# Altium project GECKO3.PRJPCB (part 2 of 4)

## Sheet fpga-config.SCHDOC: FPGA Configuration and Decoupling
size A3; Organization: Berne University of Applied Science; Address1: School of Engineering and; Address2: Information Technology; Address3: Quellgasse 21; Address4: CH-2501 Biel; Revision: 1.0; SheetNumber: 5; SheetTotal: 19; ApprovedBy: zem1; Author: zac1
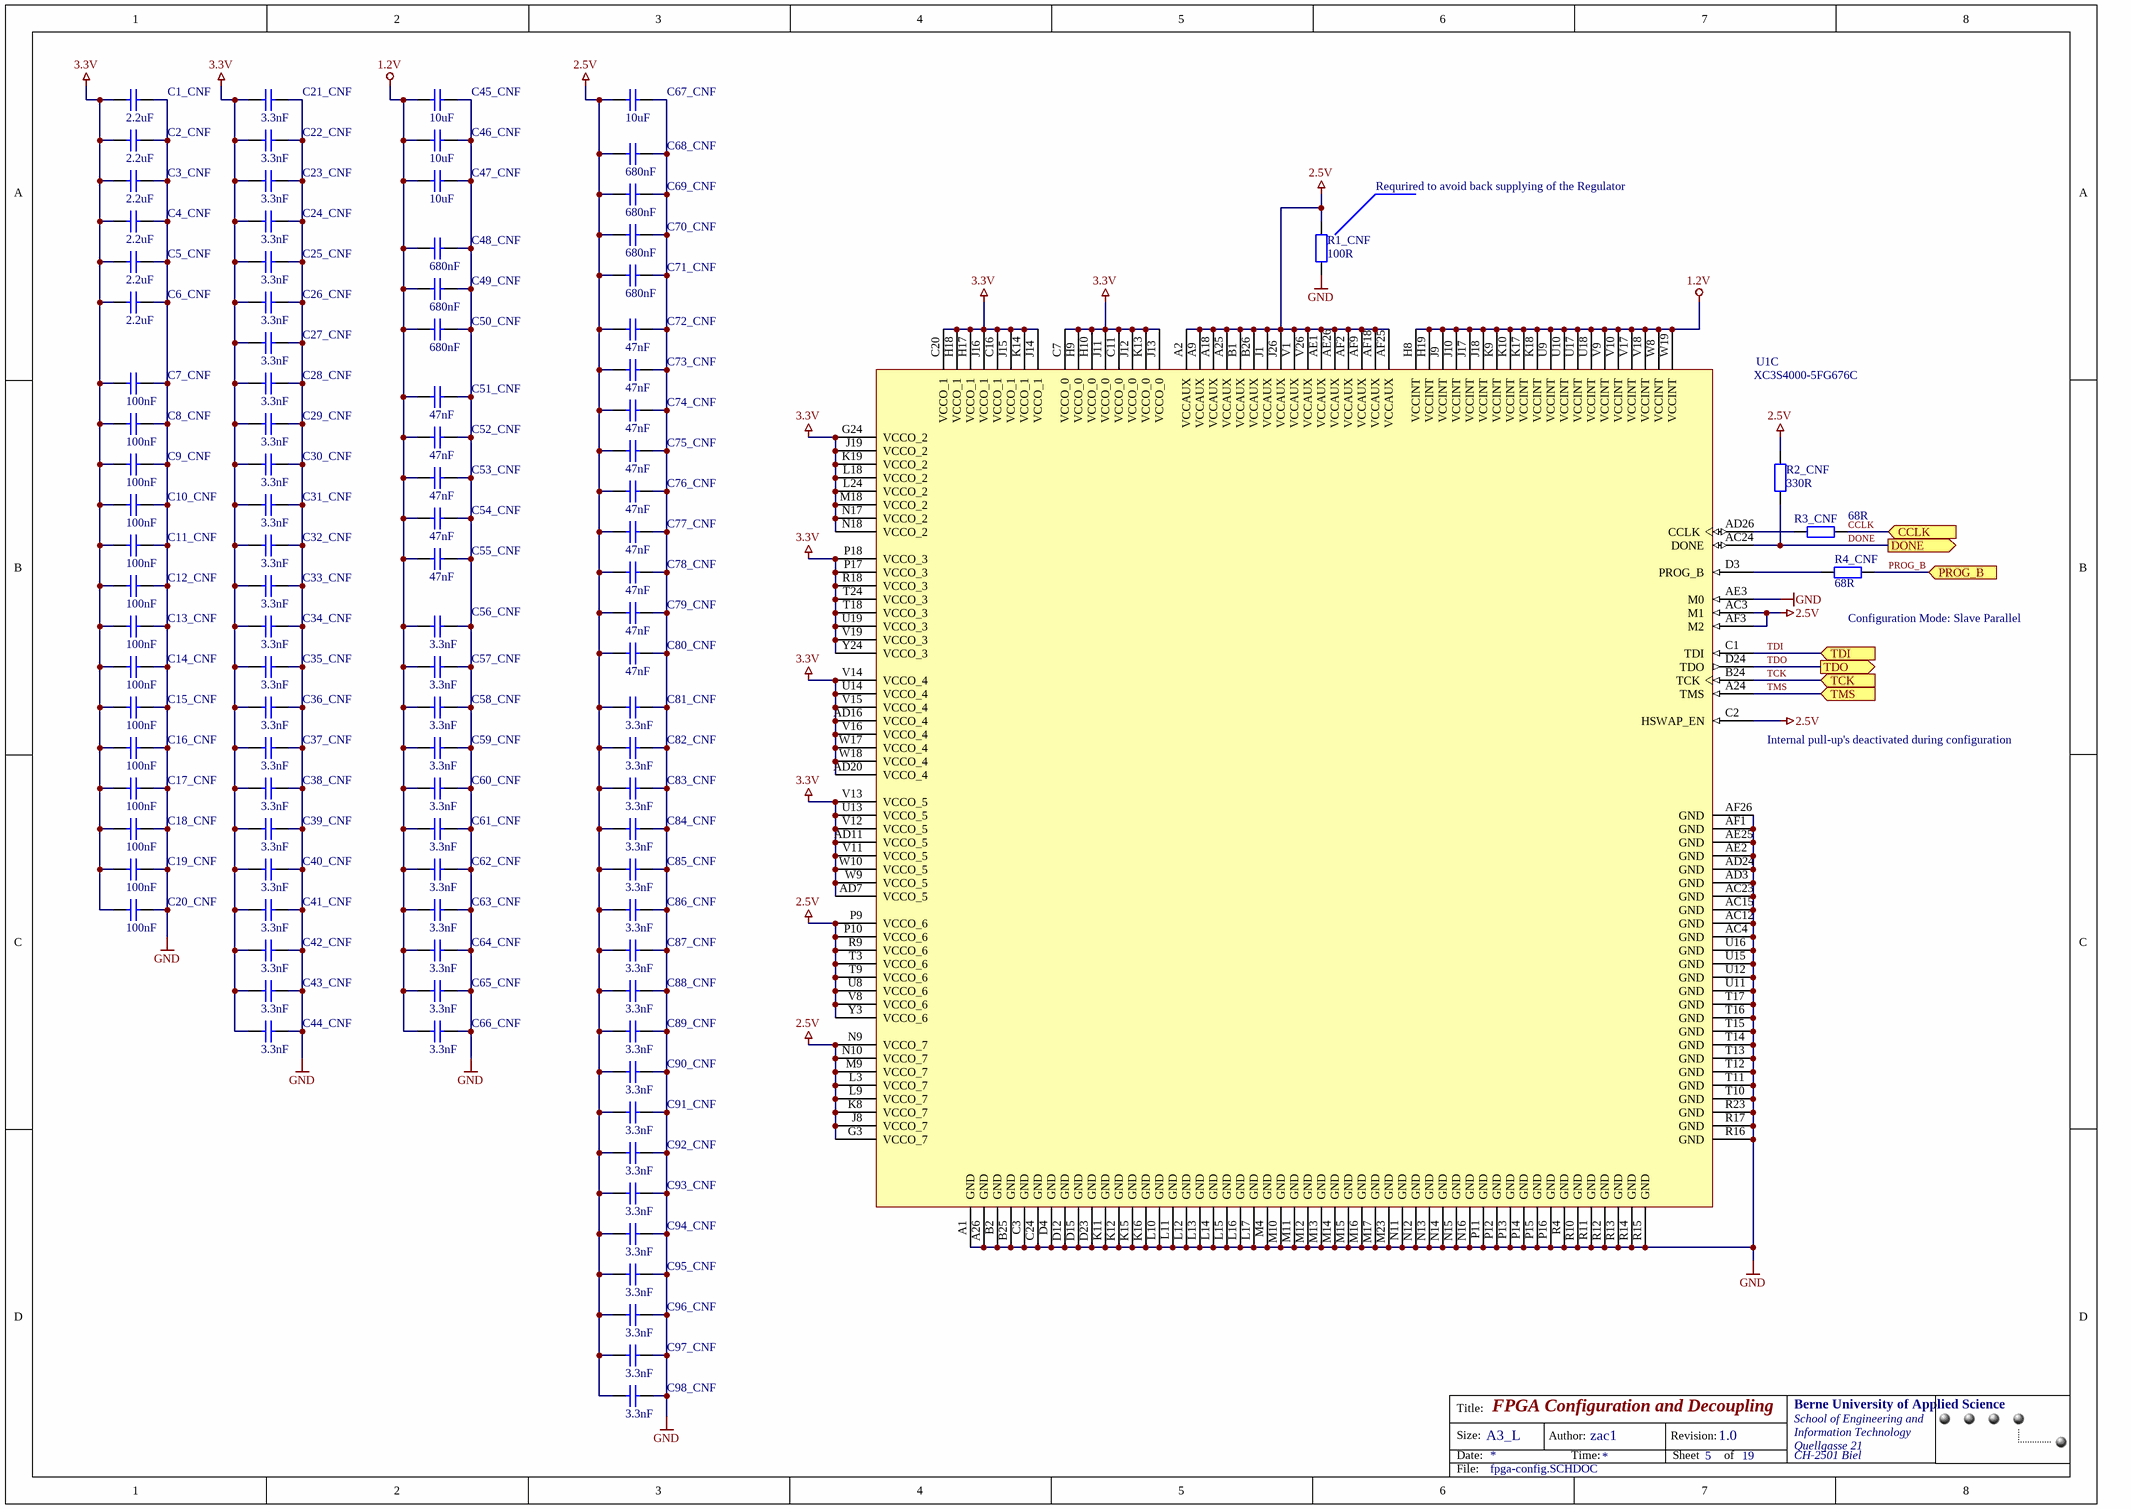
[diagram p3: fpga-config.SCHDOC]

### Parts
C1_CNF  value 2.2uF  [0805]  (hidden comment: Cap)
C2_CNF  value 2.2uF  [0805]  (hidden comment: Cap)
C3_CNF  value 2.2uF  [0805]  (hidden comment: Cap)
C4_CNF  value 2.2uF  [0805]  (hidden comment: Cap)
C5_CNF  value 2.2uF  [0805]  (hidden comment: Cap)
C6_CNF  value 2.2uF  [0805]  (hidden comment: Cap)
C7_CNF  value 100nF  [0402]  (hidden comment: Cap)
C8_CNF  value 100nF  [0402]  (hidden comment: Cap)
C9_CNF  value 100nF  [0402]  (hidden comment: Cap)
C10_CNF  value 100nF  [0402]  (hidden comment: Cap)
C11_CNF  value 100nF  [0402]  (hidden comment: Cap)
C12_CNF  value 100nF  [0402]  (hidden comment: Cap)
C13_CNF  value 100nF  [0402]  (hidden comment: Cap)
C14_CNF  value 100nF  [0402]  (hidden comment: Cap)
C15_CNF  value 100nF  [0402]  (hidden comment: Cap)
C16_CNF  value 100nF  [0402]  (hidden comment: Cap)
C17_CNF  value 100nF  [0402]  (hidden comment: Cap)
C18_CNF  value 100nF  [0402]  (hidden comment: Cap)
C19_CNF  value 100nF  [0402]  (hidden comment: Cap)
C20_CNF  value 100nF  [0402]  (hidden comment: Cap)
C21_CNF  value 3.3nF  [0402]  (hidden comment: Cap)
C22_CNF  value 3.3nF  [0402]  (hidden comment: Cap)
C23_CNF  value 3.3nF  [0402]  (hidden comment: Cap)
C24_CNF  value 3.3nF  [0402]  (hidden comment: Cap)
C25_CNF  value 3.3nF  [0402]  (hidden comment: Cap)
C26_CNF  value 3.3nF  [0402]  (hidden comment: Cap)
C27_CNF  value 3.3nF  [0402]  (hidden comment: Cap)
C28_CNF  value 3.3nF  [0402]  (hidden comment: Cap)
C29_CNF  value 3.3nF  [0402]  (hidden comment: Cap)
C30_CNF  value 3.3nF  [0402]  (hidden comment: Cap)
C31_CNF  value 3.3nF  [0402]  (hidden comment: Cap)
C32_CNF  value 3.3nF  [0402]  (hidden comment: Cap)
C33_CNF  value 3.3nF  [0402]  (hidden comment: Cap)
C34_CNF  value 3.3nF  [0402]  (hidden comment: Cap)
C35_CNF  value 3.3nF  [0402]  (hidden comment: Cap)
C36_CNF  value 3.3nF  [0402]  (hidden comment: Cap)
C37_CNF  value 3.3nF  [0402]  (hidden comment: Cap)
C38_CNF  value 3.3nF  [0402]  (hidden comment: Cap)
C39_CNF  value 3.3nF  [0402]  (hidden comment: Cap)
C40_CNF  value 3.3nF  [0402]  (hidden comment: Cap)
C41_CNF  value 3.3nF  [0402]  (hidden comment: Cap)
C42_CNF  value 3.3nF  [0402]  (hidden comment: Cap)
C43_CNF  value 3.3nF  [0402]  (hidden comment: Cap)
C44_CNF  value 3.3nF  [0402]  (hidden comment: Cap)
C45_CNF  value 10uF  [1206]  (hidden comment: Cap)
C46_CNF  value 10uF  [1206]  (hidden comment: Cap)
C47_CNF  value 10uF  [1206]  (hidden comment: Cap)
C48_CNF  value 680nF  [0805]  (hidden comment: Cap)
C49_CNF  value 680nF  [0805]  (hidden comment: Cap)
C50_CNF  value 680nF  [0805]  (hidden comment: Cap)
C51_CNF  value 47nF  [0402]  (hidden comment: Cap)
C52_CNF  value 47nF  [0402]  (hidden comment: Cap)
C53_CNF  value 47nF  [0402]  (hidden comment: Cap)
C54_CNF  value 47nF  [0402]  (hidden comment: Cap)
C55_CNF  value 47nF  [0402]  (hidden comment: Cap)
C56_CNF  value 3.3nF  [0402]  (hidden comment: Cap)
C57_CNF  value 3.3nF  [0402]  (hidden comment: Cap)
C58_CNF  value 3.3nF  [0402]  (hidden comment: Cap)
C59_CNF  value 3.3nF  [0402]  (hidden comment: Cap)
C60_CNF  value 3.3nF  [0402]  (hidden comment: Cap)
C61_CNF  value 3.3nF  [0402]  (hidden comment: Cap)
C62_CNF  value 3.3nF  [0402]  (hidden comment: Cap)
C63_CNF  value 3.3nF  [0402]  (hidden comment: Cap)
C64_CNF  value 3.3nF  [0402]  (hidden comment: Cap)
C65_CNF  value 3.3nF  [0402]  (hidden comment: Cap)
C66_CNF  value 3.3nF  [0402]  (hidden comment: Cap)
C67_CNF  value 10uF  [1206]  (hidden comment: Cap)
C68_CNF  value 680nF  [0805]  (hidden comment: Cap)
C69_CNF  value 680nF  [0805]  (hidden comment: Cap)
C70_CNF  value 680nF  [0805]  (hidden comment: Cap)
C71_CNF  value 680nF  [0805]  (hidden comment: Cap)
C72_CNF  value 47nF  [0402]  (hidden comment: Cap)
C73_CNF  value 47nF  [0402]  (hidden comment: Cap)
C74_CNF  value 47nF  [0402]  (hidden comment: Cap)
C75_CNF  value 47nF  [0402]  (hidden comment: Cap)
C76_CNF  value 47nF  [0402]  (hidden comment: Cap)
C77_CNF  value 47nF  [0402]  (hidden comment: Cap)
C78_CNF  value 47nF  [0402]  (hidden comment: Cap)
C79_CNF  value 47nF  [0402]  (hidden comment: Cap)
C80_CNF  value 47nF  [0402]  (hidden comment: Cap)
C81_CNF  value 3.3nF  [0402]  (hidden comment: Cap)
C82_CNF  value 3.3nF  [0402]  (hidden comment: Cap)
C83_CNF  value 3.3nF  [0402]  (hidden comment: Cap)
C84_CNF  value 3.3nF  [0402]  (hidden comment: Cap)
C85_CNF  value 3.3nF  [0402]  (hidden comment: Cap)
C86_CNF  value 3.3nF  [0402]  (hidden comment: Cap)
C87_CNF  value 3.3nF  [0402]  (hidden comment: Cap)
C88_CNF  value 3.3nF  [0402]  (hidden comment: Cap)
C89_CNF  value 3.3nF  [0402]  (hidden comment: Cap)
C90_CNF  value 3.3nF  [0402]  (hidden comment: Cap)
C91_CNF  value 3.3nF  [0402]  (hidden comment: Cap)
C92_CNF  value 3.3nF  [0402]  (hidden comment: Cap)
C93_CNF  value 3.3nF  [0402]  (hidden comment: Cap)
C94_CNF  value 3.3nF  [0402]  (hidden comment: Cap)
C95_CNF  value 3.3nF  [0402]  (hidden comment: Cap)
C96_CNF  value 3.3nF  [0402]  (hidden comment: Cap)
C97_CNF  value 3.3nF  [0402]  (hidden comment: Cap)
C98_CNF  value 3.3nF  [0402]  (hidden comment: Cap)
R1_CNF  value 100R  [0402]  (hidden comment: Res2)
R2_CNF  value 330R  [0402]  (hidden comment: Res2)
R3_CNF  value 68R  [0402]  (hidden comment: Res2)
R4_CNF  value 68R  [0402]  (hidden comment: Res2)
U1  XC3S4000-5FG676C  [FG676]  (part C of 3)

### Ports
CCLK (in), DONE (out), PROG_B (in), TCK (in), TDI (in), TDO (out), TMS (in)

### Nets
1.2V: C45_CNF.2 C46_CNF.2 C47_CNF.2 C48_CNF.2 C49_CNF.2 C50_CNF.2 C51_CNF.2 C52_CNF.2 C53_CNF.2 C54_CNF.2 C55_CNF.2 C56_CNF.2 C57_CNF.2 C58_CNF.2 C59_CNF.2 C60_CNF.2 C61_CNF.2 C62_CNF.2 C63_CNF.2 C64_CNF.2 C65_CNF.2 C66_CNF.2 U1.H8(VCCINT) U1.H19(VCCINT) U1.J9(VCCINT) U1.J10(VCCINT) U1.J17(VCCINT) U1.J18(VCCINT) U1.K9(VCCINT) U1.K10(VCCINT) U1.K17(VCCINT) U1.K18(VCCINT) U1.U9(VCCINT) U1.U10(VCCINT) U1.U17(VCCINT) U1.U18(VCCINT) U1.V9(VCCINT) U1.V10(VCCINT) U1.V17(VCCINT) U1.V18(VCCINT) U1.W8(VCCINT) U1.W19(VCCINT)
2.5V: C67_CNF.2 C68_CNF.2 C69_CNF.2 C70_CNF.2 C71_CNF.2 C72_CNF.2 C73_CNF.2 C74_CNF.2 C75_CNF.2 C76_CNF.2 C77_CNF.2 C78_CNF.2 C79_CNF.2 C80_CNF.2 C81_CNF.2 C82_CNF.2 C83_CNF.2 C84_CNF.2 C85_CNF.2 C86_CNF.2 C87_CNF.2 C88_CNF.2 C89_CNF.2 C90_CNF.2 C91_CNF.2 C92_CNF.2 C93_CNF.2 C94_CNF.2 C95_CNF.2 C96_CNF.2 C97_CNF.2 C98_CNF.2 R1_CNF.1 R2_CNF.1 U1.A2(VCCAUX) U1.A9(VCCAUX) U1.A18(VCCAUX) U1.A25(VCCAUX) U1.AC3(M1) U1.AE1(VCCAUX) U1.AE26(VCCAUX) U1.AF2(VCCAUX) U1.AF3(M2) U1.AF9(VCCAUX) U1.AF18(VCCAUX) U1.AF25(VCCAUX) U1.B1(VCCAUX) U1.B26(VCCAUX) U1.C2(HSWAP_EN) U1.G3(VCCO_7) U1.J1(VCCAUX) U1.J8(VCCO_7) U1.J26(VCCAUX) U1.K8(VCCO_7) U1.L3(VCCO_7) U1.L9(VCCO_7) U1.M9(VCCO_7) U1.N9(VCCO_7) U1.N10(VCCO_7) U1.P9(VCCO_6) U1.P10(VCCO_6) U1.R9(VCCO_6) U1.T3(VCCO_6) U1.T9(VCCO_6) U1.U8(VCCO_6) U1.V1(VCCAUX) U1.V8(VCCO_6) U1.V26(VCCAUX) U1.Y3(VCCO_6)
3.3V: C1_CNF.1 C2_CNF.1 C3_CNF.1 C4_CNF.1 C5_CNF.1 C6_CNF.1 C7_CNF.2 C8_CNF.2 C9_CNF.2 C10_CNF.2 C11_CNF.2 C12_CNF.2 C13_CNF.2 C14_CNF.2 C15_CNF.2 C16_CNF.2 C17_CNF.2 C18_CNF.2 C19_CNF.2 C20_CNF.2 C21_CNF.2 C22_CNF.2 C23_CNF.2 C24_CNF.2 C25_CNF.2 C26_CNF.2 C27_CNF.2 C28_CNF.2 C29_CNF.2 C30_CNF.2 C31_CNF.2 C32_CNF.2 C33_CNF.2 C34_CNF.2 C35_CNF.2 C36_CNF.2 C37_CNF.2 C38_CNF.2 C39_CNF.2 C40_CNF.2 C41_CNF.2 C42_CNF.2 C43_CNF.2 C44_CNF.2 U1.AD7(VCCO_5) U1.AD11(VCCO_5) U1.AD16(VCCO_4) U1.AD20(VCCO_4) U1.C7(VCCO_0) U1.C11(VCCO_0) U1.C16(VCCO_1) U1.C20(VCCO_1) U1.G24(VCCO_2) U1.H9(VCCO_0) U1.H10(VCCO_0) U1.H17(VCCO_1) U1.H18(VCCO_1) U1.J11(VCCO_0) U1.J12(VCCO_0) U1.J13(VCCO_0) U1.J14(VCCO_1) U1.J15(VCCO_1) U1.J16(VCCO_1) U1.J19(VCCO_2) U1.K13(VCCO_0) U1.K14(VCCO_1) U1.K19(VCCO_2) U1.L18(VCCO_2) U1.L24(VCCO_2) U1.M18(VCCO_2) U1.N17(VCCO_2) U1.N18(VCCO_2) U1.P17(VCCO_3) U1.P18(VCCO_3) U1.R18(VCCO_3) U1.T18(VCCO_3) U1.T24(VCCO_3) U1.U13(VCCO_5) U1.U14(VCCO_4) U1.U19(VCCO_3) U1.V11(VCCO_5) U1.V12(VCCO_5) U1.V13(VCCO_5) U1.V14(VCCO_4) U1.V15(VCCO_4) U1.V16(VCCO_4) U1.V19(VCCO_3) U1.W9(VCCO_5) U1.W10(VCCO_5) U1.W17(VCCO_4) U1.W18(VCCO_4) U1.Y24(VCCO_3)
GND: C1_CNF.2 C2_CNF.2 C3_CNF.2 C4_CNF.2 C5_CNF.2 C6_CNF.2 C7_CNF.1 C8_CNF.1 C9_CNF.1 C10_CNF.1 C11_CNF.1 C12_CNF.1 C13_CNF.1 C14_CNF.1 C15_CNF.1 C16_CNF.1 C17_CNF.1 C18_CNF.1 C19_CNF.1 C20_CNF.1 C21_CNF.1 C22_CNF.1 C23_CNF.1 C24_CNF.1 C25_CNF.1 C26_CNF.1 C27_CNF.1 C28_CNF.1 C29_CNF.1 C30_CNF.1 C31_CNF.1 C32_CNF.1 C33_CNF.1 C34_CNF.1 C35_CNF.1 C36_CNF.1 C37_CNF.1 C38_CNF.1 C39_CNF.1 C40_CNF.1 C41_CNF.1 C42_CNF.1 C43_CNF.1 C44_CNF.1 C45_CNF.1 C46_CNF.1 C47_CNF.1 C48_CNF.1 C49_CNF.1 C50_CNF.1 C51_CNF.1 C52_CNF.1 C53_CNF.1 C54_CNF.1 C55_CNF.1 C56_CNF.1 C57_CNF.1 C58_CNF.1 C59_CNF.1 C60_CNF.1 C61_CNF.1 C62_CNF.1 C63_CNF.1 C64_CNF.1 C65_CNF.1 C66_CNF.1 C67_CNF.1 C68_CNF.1 C69_CNF.1 C70_CNF.1 C71_CNF.1 C72_CNF.1 C73_CNF.1 C74_CNF.1 C75_CNF.1 C76_CNF.1 C77_CNF.1 C78_CNF.1 C79_CNF.1 C80_CNF.1 C81_CNF.1 C82_CNF.1 C83_CNF.1 C84_CNF.1 C85_CNF.1 C86_CNF.1 C87_CNF.1 C88_CNF.1 C89_CNF.1 C90_CNF.1 C91_CNF.1 C92_CNF.1 C93_CNF.1 C94_CNF.1 C95_CNF.1 C96_CNF.1 C97_CNF.1 C98_CNF.1 R1_CNF.2 U1.A1(GND) U1.A26(GND) U1.AC4(GND) U1.AC12(GND) U1.AC15(GND) U1.AC23(GND) U1.AD3(GND) U1.AD24(GND) U1.AE2(GND) U1.AE3(M0) U1.AE25(GND) U1.AF1(GND) U1.AF26(GND) U1.B2(GND) U1.B25(GND) U1.C3(GND) U1.C24(GND) U1.D4(GND) U1.D12(GND) U1.D15(GND) U1.D23(GND) U1.K11(GND) U1.K12(GND) U1.K15(GND) U1.K16(GND) U1.L10(GND) U1.L11(GND) U1.L12(GND) U1.L13(GND) U1.L14(GND) U1.L15(GND) U1.L16(GND) U1.L17(GND) U1.M4(GND) U1.M10(GND) U1.M11(GND) U1.M12(GND) U1.M13(GND) U1.M14(GND) U1.M15(GND) U1.M16(GND) U1.M17(GND) U1.M23(GND) U1.N11(GND) U1.N12(GND) U1.N13(GND) U1.N14(GND) U1.N15(GND) U1.N16(GND) U1.P11(GND) U1.P12(GND) U1.P13(GND) U1.P14(GND) U1.P15(GND) U1.P16(GND) U1.R4(GND) U1.R10(GND) U1.R11(GND) U1.R12(GND) U1.R13(GND) U1.R14(GND) U1.R15(GND) U1.R16(GND) U1.R17(GND) U1.R23(GND) U1.T10(GND) U1.T11(GND) U1.T12(GND) U1.T13(GND) U1.T14(GND) U1.T15(GND) U1.T16(GND) U1.T17(GND) U1.U11(GND) U1.U12(GND) U1.U15(GND) U1.U16(GND)
CCLK: R3_CNF.1 ; port CCLK
DONE: R2_CNF.2 U1.AC24(DONE) ; port DONE
PROG_B: R4_CNF.1 ; port PROG_B
TCK: U1.B24(TCK) ; port TCK
TDI: U1.C1(TDI) ; port TDI
TDO: U1.D24(TDO) ; port TDO
TMS: U1.A24(TMS) ; port TMS
NetR3_CNF_2: R3_CNF.2 U1.AD26(CCLK)
NetR4_CNF_2: R4_CNF.2 U1.D3(PROG_B)

### Notes on the sheet
- Requrired to avoid back supplying of the Regulator
- (near R4_CNF) Configuration Mode: Slave Parallel
- Internal pull-up's deactivated during configuration
- Title:
- Size:
- Date:
- A3_L
- Author:
- Time:
- Revision:
- Sheet
- of
- File:

### Library data of the parts
C1_CNF C2_CNF C3_CNF C4_CNF C5_CNF C6_CNF = Cap: Capacitor; Manufacturer: Murata; Part Number: GRM21BR71A225KA01L; Class I: Passive; Currency: CHF; Packaging unit: 1; Prize: 0.54; Published: 8-Jun-2000; Revision: July-2002: Re-released for DXP Platform.; Publisher: Altium Limited; Class II: Capacitor; Distributor Number: 823 517; RoHS: yes; Distributor: Distrelec
C7_CNF C8_CNF C9_CNF C10_CNF C11_CNF C12_CNF C13_CNF C14_CNF C15_CNF C16_CNF C17_CNF C18_CNF C19_CNF C20_CNF = Cap: as C11_PWR on sheet power; Published: 8-Jun-2000; Revision: July-2002: Re-released for DXP Platform.; Publisher: Altium Limited; Class II: Capacitor; Distributor Number: 8819 742; RoHS: yes; Distributor: Farnell
C21_CNF C22_CNF C23_CNF C24_CNF C25_CNF C26_CNF C27_CNF C28_CNF C29_CNF C30_CNF C31_CNF C32_CNF C33_CNF C34_CNF C35_CNF C36_CNF C37_CNF C38_CNF C39_CNF C40_CNF C41_CNF C42_CNF C43_CNF C44_CNF C56_CNF C57_CNF C58_CNF C59_CNF C60_CNF C61_CNF C62_CNF C63_CNF C64_CNF C65_CNF C66_CNF C81_CNF C82_CNF C83_CNF C84_CNF C85_CNF C86_CNF C87_CNF C88_CNF C89_CNF C90_CNF C91_CNF C92_CNF C93_CNF C94_CNF C95_CNF C96_CNF C97_CNF C98_CNF = Cap: Capacitor; Manufacturer: PHYCOMP; Part Number: 2238 587 15629; Class I: Passive; Currency: CHF; Packaging unit: 10; Prize: 0.11; Published: 8-Jun-2000; Revision: July-2002: Re-released for DXP Platform.; Publisher: Altium Limited; Class II: Capacitor; Distributor Number: 3019 410; RoHS: yes; Distributor: Farnell
C45_CNF C46_CNF C47_CNF C67_CNF = Cap: as C8_PWR on sheet power; Published: 8-Jun-2000; Revision: July-2002: Re-released for DXP Platform.; Publisher: Altium Limited; Class II: Capacitor; Distributor Number: 9527 729; RoHS: yes; Distributor: Farnell
C48_CNF C49_CNF C50_CNF C68_CNF C69_CNF C70_CNF C71_CNF = Cap: Capacitor; Manufacturer: PHYCOMP; Part Number: 2238 240 15661; Class I: Passive; Currency: CHF; Packaging unit: 10; Prize: 0.34; Published: 8-Jun-2000; Revision: July-2002: Re-released for DXP Platform.; Publisher: Altium Limited; Class II: Capacitor; Distributor Number: 3352 055; RoHS: yes; Distributor: Farnell
C51_CNF C52_CNF C53_CNF C54_CNF C55_CNF C72_CNF C73_CNF C74_CNF C75_CNF C76_CNF C77_CNF C78_CNF C79_CNF C80_CNF = Cap: Capacitor; Manufacturer: PHYCOMP; Part Number: 2238 787 19845; Class I: Passive; Currency: CHF; Packaging unit: 10; Prize: 0.15; Published: 8-Jun-2000; Revision: July-2002: Re-released for DXP Platform.; Publisher: Altium Limited; Class II: Capacitor; Distributor Number: 3019 469; RoHS: yes; Distributor: Farnell
R1_CNF = Res2: Resistor; Manufacturer: PHYCOMP; Part Number: 232270671001; Class I: Passive; Currency: CHF; Packaging unit: 50; Prize: 0.12; Published: 8-Jun-2000; Revision: July-2002: Re-released for DXP Platform.; Publisher: Altium Limited; Class II: Resistor; Distributor Number: 9239111; RoHS: yes; Distributor: Farnell
R2_CNF = Res2: Resistor; Manufacturer: PHYCOMP; Part Number: 232270673301; Class I: Passive; Currency: CHF; Packaging unit: 50; Prize: 0.12; Published: 8-Jun-2000; Revision: July-2002: Re-released for DXP Platform.; Publisher: Altium Limited; Class II: Resistor; Distributor Number: 9239170; RoHS: yes; Distributor: Farnell
R3_CNF R4_CNF = Res2: Resistor; Manufacturer: PHYCOMP; Part Number: 232270676809; Class I: Passive; Currency: CHF; Packaging unit: 50; Prize: 0.12; Published: 8-Jun-2000; Revision: July-2002: Re-released for DXP Platform.; Publisher: Altium Limited; Class II: Resistor; Distributor Number: 9239090; RoHS: yes; Distributor: Farnell
U1 = XC3S1500-5FG676C: Spartan-3 1.2V FPGA, 487 User I/Os, 676-ball FBGA, High Performance, Commercial Grade; Manufacturer: Xilinx; PackageDocument: ver1.1, Apr-2001; Currency: CHF; lead time: 6 Weeks; Packaging unit: 40; Prize: 184.72; Published: 17-Sep-2003; LatestRevisionDate: 6-Jun-2005; LatestRevisionNote: Bubble removed from PROG_B pin.; DatasheetDocument: 04-Mar-2004; PackageReference: FG676; Publisher: Altium Limited; Code_JEDEC: MS-034-AAL-1; Code_IPC: PBGA 27X27 FE676; ComponentLink1Description: Manufacturer Link; ComponentLink1URL: http://www.xilinx.com/xlnx/xil_prodcat_landingpage.jsp?title=Spartan-3; ComponentLink2Description: Datasheet; ComponentLink2URL: http://direct.xilinx.com/bvdocs/publications/ds099.pdf; Value: XC3S4000-5FG676C; Distributor Number: XC3S40005FGG676C; Part Number: XC3S4000-5FG676C; RoHS: yes; Distributor: Silica

## Sheet fpga1.SchDoc: FPGA First Part
size A2; Organization: Berne University of Applied Science; Address1: School of Engineering and; Address2: Information Technology; Address3: Quellgasse 21; Address4: CH-2501 Biel; Revision: 1.0; SheetNumber: 3; SheetTotal: 19; ApprovedBy: zem1; Author: zac1; PageSetup: Record=PageOptions|CenterHorizontal=True|CenterVertical=True|PrintScale=0.71|XCorrection=1.00|YCorrection=1.00|PrintKind=0|BorderSize=5000000|LeftOffset=0|BottomOffset=0|Orientation=2|PaperLength=1000|PaperWidth=1000|Scale=100|PaperSource=15|PrintQuality=4000|MediaType=1|DitherType=0|PaperKind=A3|PrintScaleMode=1
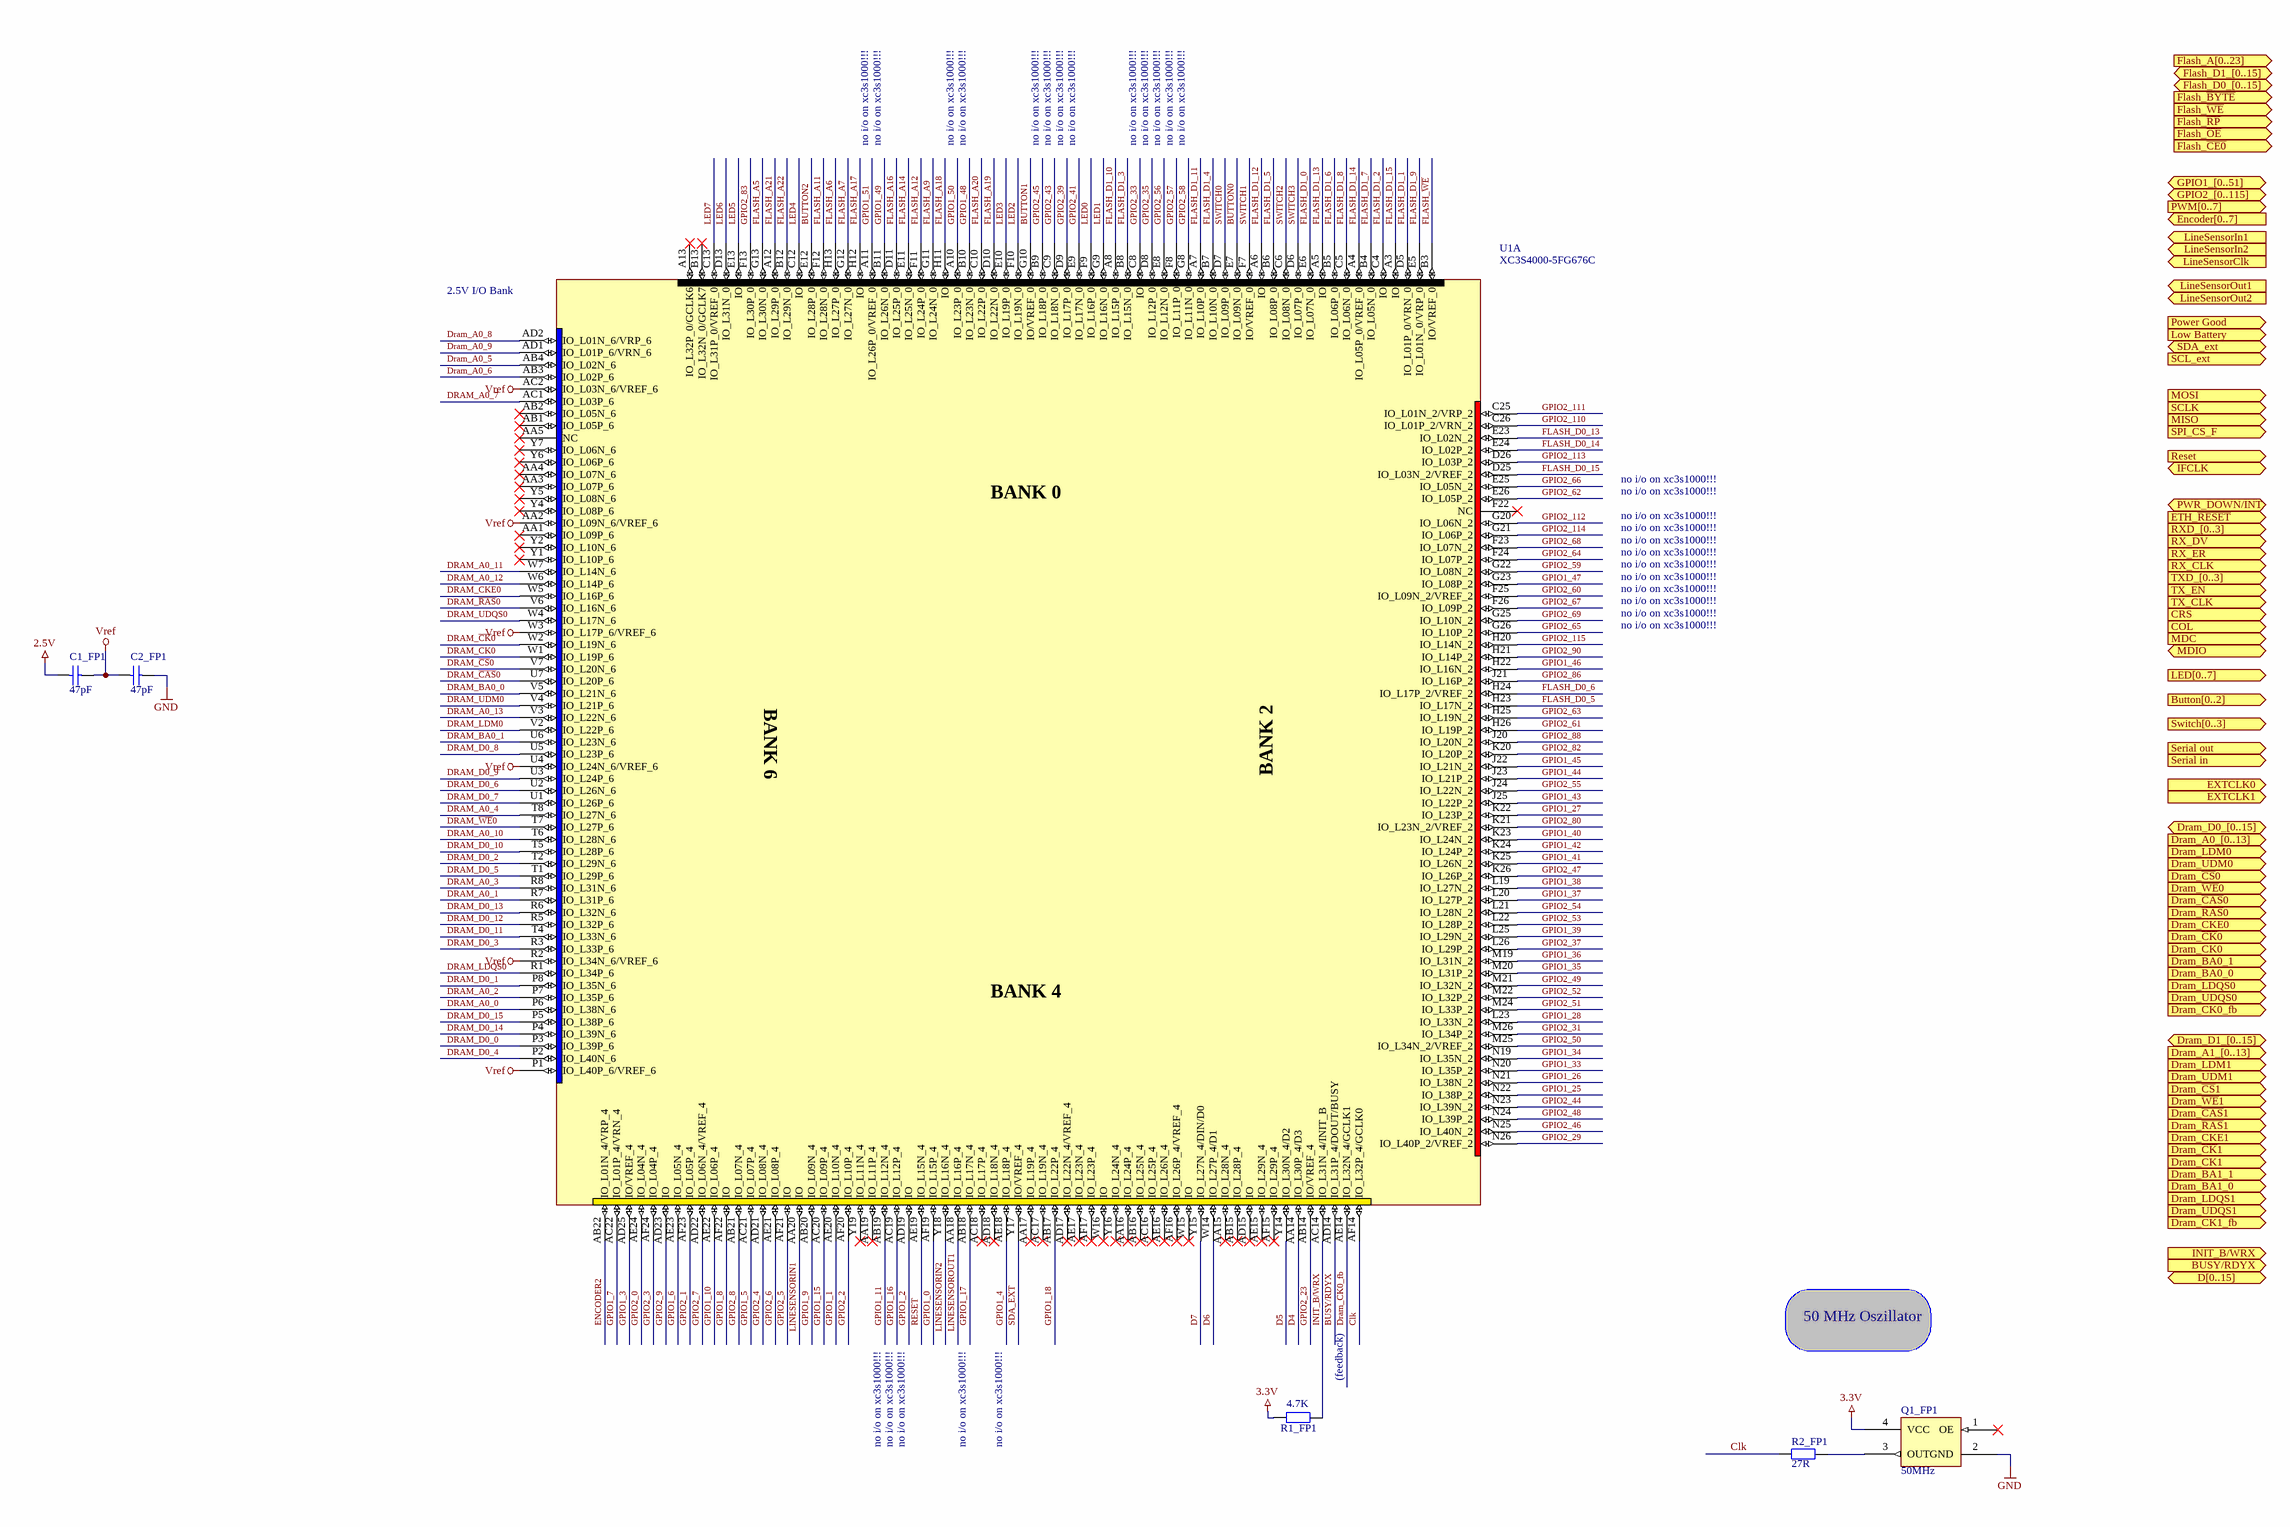
[diagram p4: fpga1.SchDoc]

### Parts
C1_FP1  value 47pF  [0402]  (hidden comment: Cap)
C2_FP1  value 47pF  [0402]  (hidden comment: Cap)
Q1_FP1  50MHz  [SMD-VX3E]
R1_FP1  value 4.7K  [0402]  (hidden comment: Res2)
R2_FP1  value 27R  [0402]  (hidden comment: Res2)
U1  XC3S4000-5FG676C  [FG676]  (part A of 3)

### Ports
BUSY/RDYX (out), Button[0..2] (in), COL (in), CRS (in), D[0..15] (bidir), Dram_A0_[0..13] (out), Dram_A1_[0..13] (out), Dram_BA0_0 (out), Dram_BA0_1 (out), Dram_BA1_0 (out), Dram_BA1_1 (out), Dram_CK0 (out), Dram_CK0_fb (in), Dram_CK1 (out), Dram_CK1_fb (in), Dram_CKE0 (out), Dram_CKE1 (out), Dram_D0_[0..15] (bidir), Dram_D1_[0..15] (bidir), Dram_LDM0 (out), Dram_LDM1 (out), Dram_LDQS0 (out), Dram_LDQS1 (out), Dram_UDM0 (out), Dram_UDM1 (out), Dram_UDQS0 (out), Dram_UDQS1 (out), Dram_~{CAS}0 (out), Dram_~{CAS}1 (out), Dram_~{CK}0 (out), Dram_~{CK}1 (out), Dram_~{CS}0 (out), Dram_~{CS}1 (out), Dram_~{RAS}0 (out), Dram_~{RAS}1 (out), Dram_~{WE}0 (out), Dram_~{WE}1 (out), Encoder[0..7] (in), ETH_~{RESET} (out), EXTCLK0 (in), EXTCLK1 (in), Flash_A[0..23] (out), Flash_D0_[0..15] (bidir), Flash_D1_[0..15] (bidir), Flash_~{BYTE} (out), Flash_~{CE0} (out), Flash_~{OE} (out), Flash_~{RP} (out), Flash_~{WE} (out), GPIO1_[0..51] (bidir), GPIO2_[0..115] (bidir), IFCLK (bidir), INIT_B/WRX (out), LED[0..7] (out), LineSensorClk (out), LineSensorIn1 (out), LineSensorIn2 (out), LineSensorOut1 (in), LineSensorOut2 (in), Low Battery (in), MDC (out), MDIO (bidir), MISO (in), MOSI (in), Power Good (in), PWM[0..7] (out), PWR_DOWN/INT (bidir), Reset (in), RX_CLK (in), RX_DV (in), RX_ER (in), RXD_[0..3] (in), SCL_ext (out), SCLK (in), SDA_ext (bidir), Serial in (in), Serial out (out), SPI_CS_F (in), Switch[0..3] (in), TX_CLK (in), TX_EN (out), TXD_[0..3] (out)

### Nets
2.5V: C1_FP1.2
3.3V: Q1_FP1.4(VCC) R1_FP1.1
GND: C2_FP1.1 Q1_FP1.2(GND)
Vref: C1_FP1.1 C2_FP1.2 U1.AA2(IO_L09N_6/VREF_6) U1.AC2(IO_L03N_6/VREF_6) U1.P1(IO_L40P_6/VREF_6) U1.R2(IO_L34N_6/VREF_6) U1.U4(IO_L24N_6/VREF_6) U1.W3(IO_L17P_6/VREF_6)
BUSY/RDYX: U1.AD14(IO_L31P_4/DOUT/BUSY) ; port BUSY/RDYX
BUTTON0: U1.E7(IO_L09N_0)
BUTTON1: U1.G10(IO/VREF_0)
BUTTON2: U1.E12(IO_L28P_0)
Clk: R2_FP1.1 U1.AF14(IO_L32P_4/GCLK0)
D4: U1.AA14(IO_L30P_4/D3)
D5: U1.Y14(IO_L30N_4/D2)
D6: U1.W14(IO_L27P_4/D1)
D7: U1.Y15(IO_L27N_4/DIN/D0)
DRAM_A0_0: U1.P6(IO_L38N_6)
DRAM_A0_1: U1.R7(IO_L31P_6)
DRAM_A0_2: U1.P7(IO_L35P_6)
DRAM_A0_3: U1.R8(IO_L31N_6)
DRAM_A0_4: U1.T8(IO_L27N_6)
Dram_A0_5: U1.AB4(IO_L02N_6)
Dram_A0_6: U1.AB3(IO_L02P_6)
DRAM_A0_7: U1.AC1(IO_L03P_6)
Dram_A0_8: U1.AD2(IO_L01N_6/VRP_6)
Dram_A0_9: U1.AD1(IO_L01P_6/VRN_6)
DRAM_A0_10: U1.T6(IO_L28N_6)
DRAM_A0_11: U1.W7(IO_L14N_6)
DRAM_A0_12: U1.W6(IO_L14P_6)
DRAM_A0_13: U1.V3(IO_L22N_6)
DRAM_BA0_0: U1.V5(IO_L21N_6) ; port Dram_BA0_0
DRAM_BA0_1: U1.U6(IO_L23N_6) ; port Dram_BA0_1
DRAM_~{CAS}0: U1.U7(IO_L20P_6) ; port Dram_~{CAS}0
DRAM_~{CK}0: U1.W2(IO_L19N_6) ; port Dram_~{CK}0
DRAM_~{CS}0: U1.V7(IO_L20N_6) ; port Dram_~{CS}0
DRAM_CK0: U1.W1(IO_L19P_6) ; port Dram_CK0
Dram_CK0_fb: U1.AE14(IO_L32N_4/GCLK1) ; port Dram_CK0_fb
DRAM_CKE0: U1.W5(IO_L16P_6) ; port Dram_CKE0
DRAM_D0_0: U1.P3(IO_L39P_6)
DRAM_D0_1: U1.P8(IO_L35N_6)
DRAM_D0_2: U1.T2(IO_L29N_6)
DRAM_D0_3: U1.R3(IO_L33P_6)
DRAM_D0_4: U1.P2(IO_L40N_6)
DRAM_D0_5: U1.T1(IO_L29P_6)
DRAM_D0_6: U1.U2(IO_L26N_6)
DRAM_D0_7: U1.U1(IO_L26P_6)
DRAM_D0_8: U1.U5(IO_L23P_6)
DRAM_D0_9: U1.U3(IO_L24P_6)
DRAM_D0_10: U1.T5(IO_L28P_6)
DRAM_D0_11: U1.T4(IO_L33N_6)
DRAM_D0_12: U1.R5(IO_L32P_6)
DRAM_D0_13: U1.R6(IO_L32N_6)
DRAM_D0_14: U1.P4(IO_L39N_6)
DRAM_D0_15: U1.P5(IO_L38P_6)
DRAM_LDM0: U1.V2(IO_L22P_6) ; port Dram_LDM0
DRAM_LDQS0: U1.R1(IO_L34P_6) ; port Dram_LDQS0
DRAM_~{RAS}0: U1.V6(IO_L16N_6) ; port Dram_~{RAS}0
DRAM_UDM0: U1.V4(IO_L21P_6) ; port Dram_UDM0
DRAM_UDQS0: U1.W4(IO_L17N_6) ; port Dram_UDQS0
DRAM_~{WE}0: U1.T7(IO_L27P_6) ; port Dram_~{WE}0
ENCODER2: U1.AB22(IO_L01N_4/VRP_4)
FLASH_A5: U1.G13(IO_L30N_0)
FLASH_A6: U1.H13(IO_L27P_0)
FLASH_A7: U1.G12(IO_L27N_0)
FLASH_A9: U1.G11(IO_L24N_0)
FLASH_A11: U1.F12(IO_L28N_0)
FLASH_A12: U1.F11(IO_L24P_0)
FLASH_A14: U1.E11(IO_L25N_0)
FLASH_A16: U1.D11(IO_L25P_0)
FLASH_A17: U1.H12(IO)
FLASH_A18: U1.H11(IO)
FLASH_A19: U1.D10(IO_L22N_0)
FLASH_A20: U1.C10(IO_L22P_0)
FLASH_A21: U1.A12(IO_L29P_0)
FLASH_A22: U1.B12(IO_L29N_0)
FLASH_D0_5: U1.H23(IO_L17N_2)
FLASH_D0_6: U1.H24(IO_L17P_2/VREF_2)
FLASH_D0_13: U1.E23(IO_L02N_2)
FLASH_D0_14: U1.E24(IO_L02P_2)
FLASH_D0_15: U1.D25(IO_L03N_2/VREF_2)
FLASH_D1_0: U1.E6(IO_L07N_0)
FLASH_D1_1: U1.D5(IO_L01P_0/VRN_0)
FLASH_D1_2: U1.C4(IO)
FLASH_D1_3: U1.B8(IO_L15N_0)
FLASH_D1_4: U1.B7(IO_L10N_0)
FLASH_D1_5: U1.B6(IO_L08P_0)
FLASH_D1_6: U1.B5(IO_L06P_0)
FLASH_D1_7: U1.B4(IO_L05N_0)
FLASH_D1_8: U1.C5(IO_L06N_0)
FLASH_D1_9: U1.E5(IO_L01N_0/VRP_0)
FLASH_D1_10: U1.A8(IO_L15P_0)
FLASH_D1_11: U1.A7(IO_L10P_0)
FLASH_D1_12: U1.A6(IO)
FLASH_D1_13: U1.A5(IO)
FLASH_D1_14: U1.A4(IO_L05P_0/VREF_0)
FLASH_D1_15: U1.A3(IO)
FLASH_~{WE}: U1.B3(IO/VREF_0) ; port Flash_~{WE}
GPIO1_0: U1.AF19(IO_L15P_4)
GPIO1_1: U1.AE20(IO_L10N_4)
GPIO1_2: U1.AD19(IO)
GPIO1_3: U1.AD25(IO/VREF_4)
GPIO1_4: U1.AE18(IO_L18P_4)
GPIO1_5: U1.AC21(IO_L07P_4)
GPIO1_6: U1.AE23(IO_L05N_4)
GPIO1_7: U1.AC22(IO_L01P_4/VRN_4)
GPIO1_8: U1.AF22(IO)
GPIO1_9: U1.AB20(IO_L09N_4)
GPIO1_10: U1.AE22(IO_L06P_4)
GPIO1_11: U1.AB19(IO_L12N_4)
GPIO1_15: U1.AC20(IO_L09P_4)
GPIO1_16: U1.AC19(IO_L12P_4)
GPIO1_17: U1.AB18(IO_L17N_4)
GPIO1_18: U1.AB17(IO_L22P_4)
GPIO1_25: U1.N22(IO_L38P_2)
GPIO1_26: U1.N21(IO_L38N_2)
GPIO1_27: U1.K22(IO_L23P_2)
GPIO1_28: U1.L23(IO_L33N_2)
GPIO1_33: U1.N20(IO_L35P_2)
GPIO1_34: U1.N19(IO_L35N_2)
GPIO1_35: U1.M20(IO_L31P_2)
GPIO1_36: U1.M19(IO_L31N_2)
GPIO1_37: U1.L20(IO_L27P_2)
GPIO1_38: U1.L19(IO_L27N_2)
GPIO1_39: U1.L25(IO_L29N_2)
GPIO1_40: U1.K23(IO_L24N_2)
GPIO1_41: U1.K25(IO_L26N_2)
GPIO1_42: U1.K24(IO_L24P_2)
GPIO1_43: U1.J25(IO_L22P_2)
GPIO1_44: U1.J23(IO_L21P_2)
GPIO1_45: U1.J22(IO_L21N_2)
GPIO1_46: U1.H22(IO_L16N_2)
GPIO1_47: U1.G23(IO_L08P_2)
GPIO1_48: U1.B10(IO_L23N_0)
GPIO1_49: U1.B11(IO_L26N_0)
GPIO1_50: U1.A10(IO_L23P_0)
GPIO1_51: U1.A11(IO_L26P_0/VREF_0)
GPIO2_0: U1.AE24(IO_L04N_4)
GPIO2_1: U1.AF23(IO_L05P_4)
GPIO2_2: U1.AF20(IO_L10P_4)
GPIO2_3: U1.AF24(IO_L04P_4)
GPIO2_4: U1.AD21(IO_L08N_4)
GPIO2_5: U1.AF21(IO)
GPIO2_6: U1.AE21(IO_L08P_4)
GPIO2_7: U1.AD22(IO_L06N_4/VREF_4)
GPIO2_8: U1.AB21(IO_L07N_4)
GPIO2_9: U1.AD23(IO)
GPIO2_23: U1.AB14(IO/VREF_4)
GPIO2_29: U1.N26(IO_L40P_2/VREF_2)
GPIO2_31: U1.M26(IO_L34P_2)
GPIO2_33: U1.C8(IO)
GPIO2_35: U1.D8(IO_L12P_0)
GPIO2_37: U1.L26(IO_L29P_2)
GPIO2_39: U1.D9(IO_L17P_0)
GPIO2_41: U1.E9(IO_L17N_0)
GPIO2_43: U1.C9(IO_L18N_0)
GPIO2_44: U1.N23(IO_L39N_2)
GPIO2_45: U1.B9(IO_L18P_0)
GPIO2_46: U1.N25(IO_L40N_2)
GPIO2_47: U1.K26(IO_L26P_2)
GPIO2_48: U1.N24(IO_L39P_2)
GPIO2_49: U1.M21(IO_L32N_2)
GPIO2_50: U1.M25(IO_L34N_2/VREF_2)
GPIO2_51: U1.M24(IO_L33P_2)
GPIO2_52: U1.M22(IO_L32P_2)
GPIO2_53: U1.L22(IO_L28P_2)
GPIO2_54: U1.L21(IO_L28N_2)
GPIO2_55: U1.J24(IO_L22N_2)
GPIO2_56: U1.E8(IO_L12N_0)
GPIO2_57: U1.F8(IO_L11P_0)
GPIO2_58: U1.G8(IO_L11N_0)
GPIO2_59: U1.G22(IO_L08N_2)
GPIO2_60: U1.F25(IO_L09N_2/VREF_2)
GPIO2_61: U1.H26(IO_L19P_2)
GPIO2_62: U1.E26(IO_L05P_2)
GPIO2_63: U1.H25(IO_L19N_2)
GPIO2_64: U1.F24(IO_L07P_2)
GPIO2_65: U1.G26(IO_L10P_2)
GPIO2_66: U1.E25(IO_L05N_2)
GPIO2_67: U1.F26(IO_L09P_2)
GPIO2_68: U1.F23(IO_L07N_2)
GPIO2_69: U1.G25(IO_L10N_2)
GPIO2_80: U1.K21(IO_L23N_2/VREF_2)
GPIO2_82: U1.K20(IO_L20P_2)
GPIO2_83: U1.F13(IO_L30P_0)
GPIO2_86: U1.J21(IO_L16P_2)
GPIO2_88: U1.J20(IO_L20N_2)
GPIO2_90: U1.H21(IO_L14P_2)
GPIO2_110: U1.C26(IO_L01P_2/VRN_2)
GPIO2_111: U1.C25(IO_L01N_2/VRP_2)
GPIO2_112: U1.G20(IO_L06N_2)
GPIO2_113: U1.D26(IO_L03P_2)
GPIO2_114: U1.G21(IO_L06P_2)
GPIO2_115: U1.H20(IO_L14N_2)
INIT_B/WRX: R1_FP1.2 U1.AC14(IO_L31N_4/INIT_B) ; port INIT_B/WRX
LED0: U1.F9(IO_L16P_0)
LED1: U1.G9(IO_L16N_0)
LED2: U1.F10(IO_L19N_0)
LED3: U1.E10(IO_L19P_0)
LED4: U1.C12(IO)
LED5: U1.E13(IO)
LED6: U1.D13(IO_L31N_0)
LED7: U1.C13(IO_L31P_0/VREF_0)
LINESENSORIN1: U1.AA20(IO) ; port LineSensorIn1
LINESENSORIN2: U1.Y18(IO_L16N_4) ; port LineSensorIn2
LINESENSOROUT1: U1.AA18(IO_L16P_4) ; port LineSensorOut1
RESET: U1.AE19(IO_L15N_4) ; port Reset
SDA_EXT: U1.Y17(IO/VREF_4) ; port SDA_ext
SWITCH0: U1.D7(IO_L09P_0)
SWITCH1: U1.F7(IO/VREF_0)
SWITCH2: U1.C6(IO_L08N_0)
SWITCH3: U1.D6(IO_L07P_0)
NetQ1_FP1_3: Q1_FP1.3(OUT) R2_FP1.2

Not connected (* = marked no-connect by the designer): Q1_FP1 1(OE)*; U1 A13(IO_L32P_0/GCLK6)* AA1(IO_L09P_6)* AA3(IO_L07P_6)* AA4(IO_L07N_6)* AA5(NC)* AA15(IO_L28N_4)* AA16(IO_L24P_4)* AA17(IO_L19P_4)* AA19(IO_L11P_4)* AB1(IO_L05P_6)* AB2(IO_L05N_6)* AB15(IO_L28P_4)* AB16(IO_L25N_4)* AC16(IO_L25P_4)* AC17(IO_L19N_4)* AC18(IO_L17P_4)* AD15(IO)* AD17(IO_L22N_4/VREF_4)* AD18(IO_L18N_4)* AE15(IO_L29N_4)* AE16(IO_L26N_4)* AE17(IO_L23N_4)* AF15(IO_L29P_4)* AF16(IO_L26P_4/VREF_4)* AF17(IO_L23P_4)* B13(IO_L32N_0/GCLK7)* F22(NC)* W15(IO)* W16(IO)* Y1(IO_L10P_6)* Y2(IO_L10N_6)* Y4(IO_L08P_6)* Y5(IO_L08N_6)* Y6(IO_L06P_6)* Y7(IO_L06N_6)* Y16(IO_L24N_4)* Y19(IO_L11N_4)*

### Notes on the sheet
- no i/o on xc3s1000!!!
- (near U1) 2.5V I/O Bank
- (near R1_FP1) (feedback)
- 50 MHz Oszillator
- Title:
- Size:
- Date:
- File:
- A2_L
- Author:
- Time:
- Revision:
- Sheet
- of
- (in symbol XC3S1500-5FG676C, part A) BANK 0; BANK 6; BANK 2; BANK 4

### Library data of the parts
C1_FP1 C2_FP1 = Cap: Capacitor; Manufacturer: Murata; Part Number: GRM1555C1H470JZ01D; Class I: Passive; Currency: CHF; Packaging unit: 10; Prize: 0.07; Published: 8-Jun-2000; Revision: July-2002: Re-released for DXP Platform.; Publisher: Altium Limited; Class II: Capacitor; Distributor Number: 8819 670; RoHS: yes; Distributor: Farnell
Q1_FP1 = QUARZ_OSZI_SMD: TTL Quarz Oszillator; Manufacturer: Jauch; Part Number: VX3MH-5000; Value: 50MHz-osc; Currency: CHF; Packaging unit: 1; Prize: 6.99; Distributor Number: 644127; RoHS: yes; Distributor: Distrelec
R1_FP1 = Res2: Resistor; Manufacturer: PHYCOMP; Part Number: 232270674702; Class I: Passive; Currency: CHF; Packaging unit: 50; Prize: 0.12; Published: 8-Jun-2000; Revision: July-2002: Re-released for DXP Platform.; Publisher: Altium Limited; Class II: Resistor; Distributor Number: 9239316; RoHS: yes; Distributor: Farnell
R2_FP1 = Res2: Resistor; Manufacturer: PHYCOMP; Part Number: 232270672709; Class I: Passive; Currency: CHF; Packaging unit: 50; Prize: 0.12; Published: 8-Jun-2000; Revision: July-2002: Re-released for DXP Platform.; Publisher: Altium Limited; Class II: Resistor; Distributor Number: 9239049; RoHS: yes; Distributor: Farnell
U1 = XC3S1500-5FG676C: Spartan-3 1.2V FPGA, 487 User I/Os, 676-ball FBGA, High Performance, Commercial Grade; Manufacturer: Xilinx; PackageDocument: ver1.1, Apr-2001; Currency: CHF; lead time: 6 Weeks; Packaging unit: 40; Prize: 184.72; Published: 17-Sep-2003; LatestRevisionDate: 6-Jun-2005; LatestRevisionNote: Bubble removed from PROG_B pin.; DatasheetDocument: 04-Mar-2004; PackageReference: FG676; Publisher: Altium Limited; Code_JEDEC: MS-034-AAL-1; Code_IPC: PBGA 27X27 FE676; ComponentLink1Description: Manufacturer Link; ComponentLink1URL: http://www.xilinx.com/xlnx/xil_prodcat_landingpage.jsp?title=Spartan-3; ComponentLink2Description: Datasheet; ComponentLink2URL: http://direct.xilinx.com/bvdocs/publications/ds099.pdf; Value: XC3S4000-5FG676C; Distributor Number: XC3S40005FGG676C; Part Number: XC3S4000-5FG676C; RoHS: yes; Distributor: Silica

## Sheet fpga2.SCHDOC: FPGA Second Part
size A2; Organization: Berne University of Applied Science; Address1: School of Engineering and; Address2: Information Technology; Address3: Quellgasse 21; Address4: CH-2501 Biel; Revision: 1.0; SheetNumber: 4; SheetTotal: 19; ApprovedBy: zem1; Author: zac1; PageSetup: Record=PageOptions|CenterHorizontal=True|CenterVertical=True|PrintScale=0.71|XCorrection=1.00|YCorrection=1.00|PrintKind=0|BorderSize=5000000|LeftOffset=0|BottomOffset=0|Orientation=2|PaperLength=1000|PaperWidth=1000|Scale=100|PaperSource=15|PrintQuality=4000|MediaType=1|DitherType=0|PaperKind=A3|PrintScaleMode=1
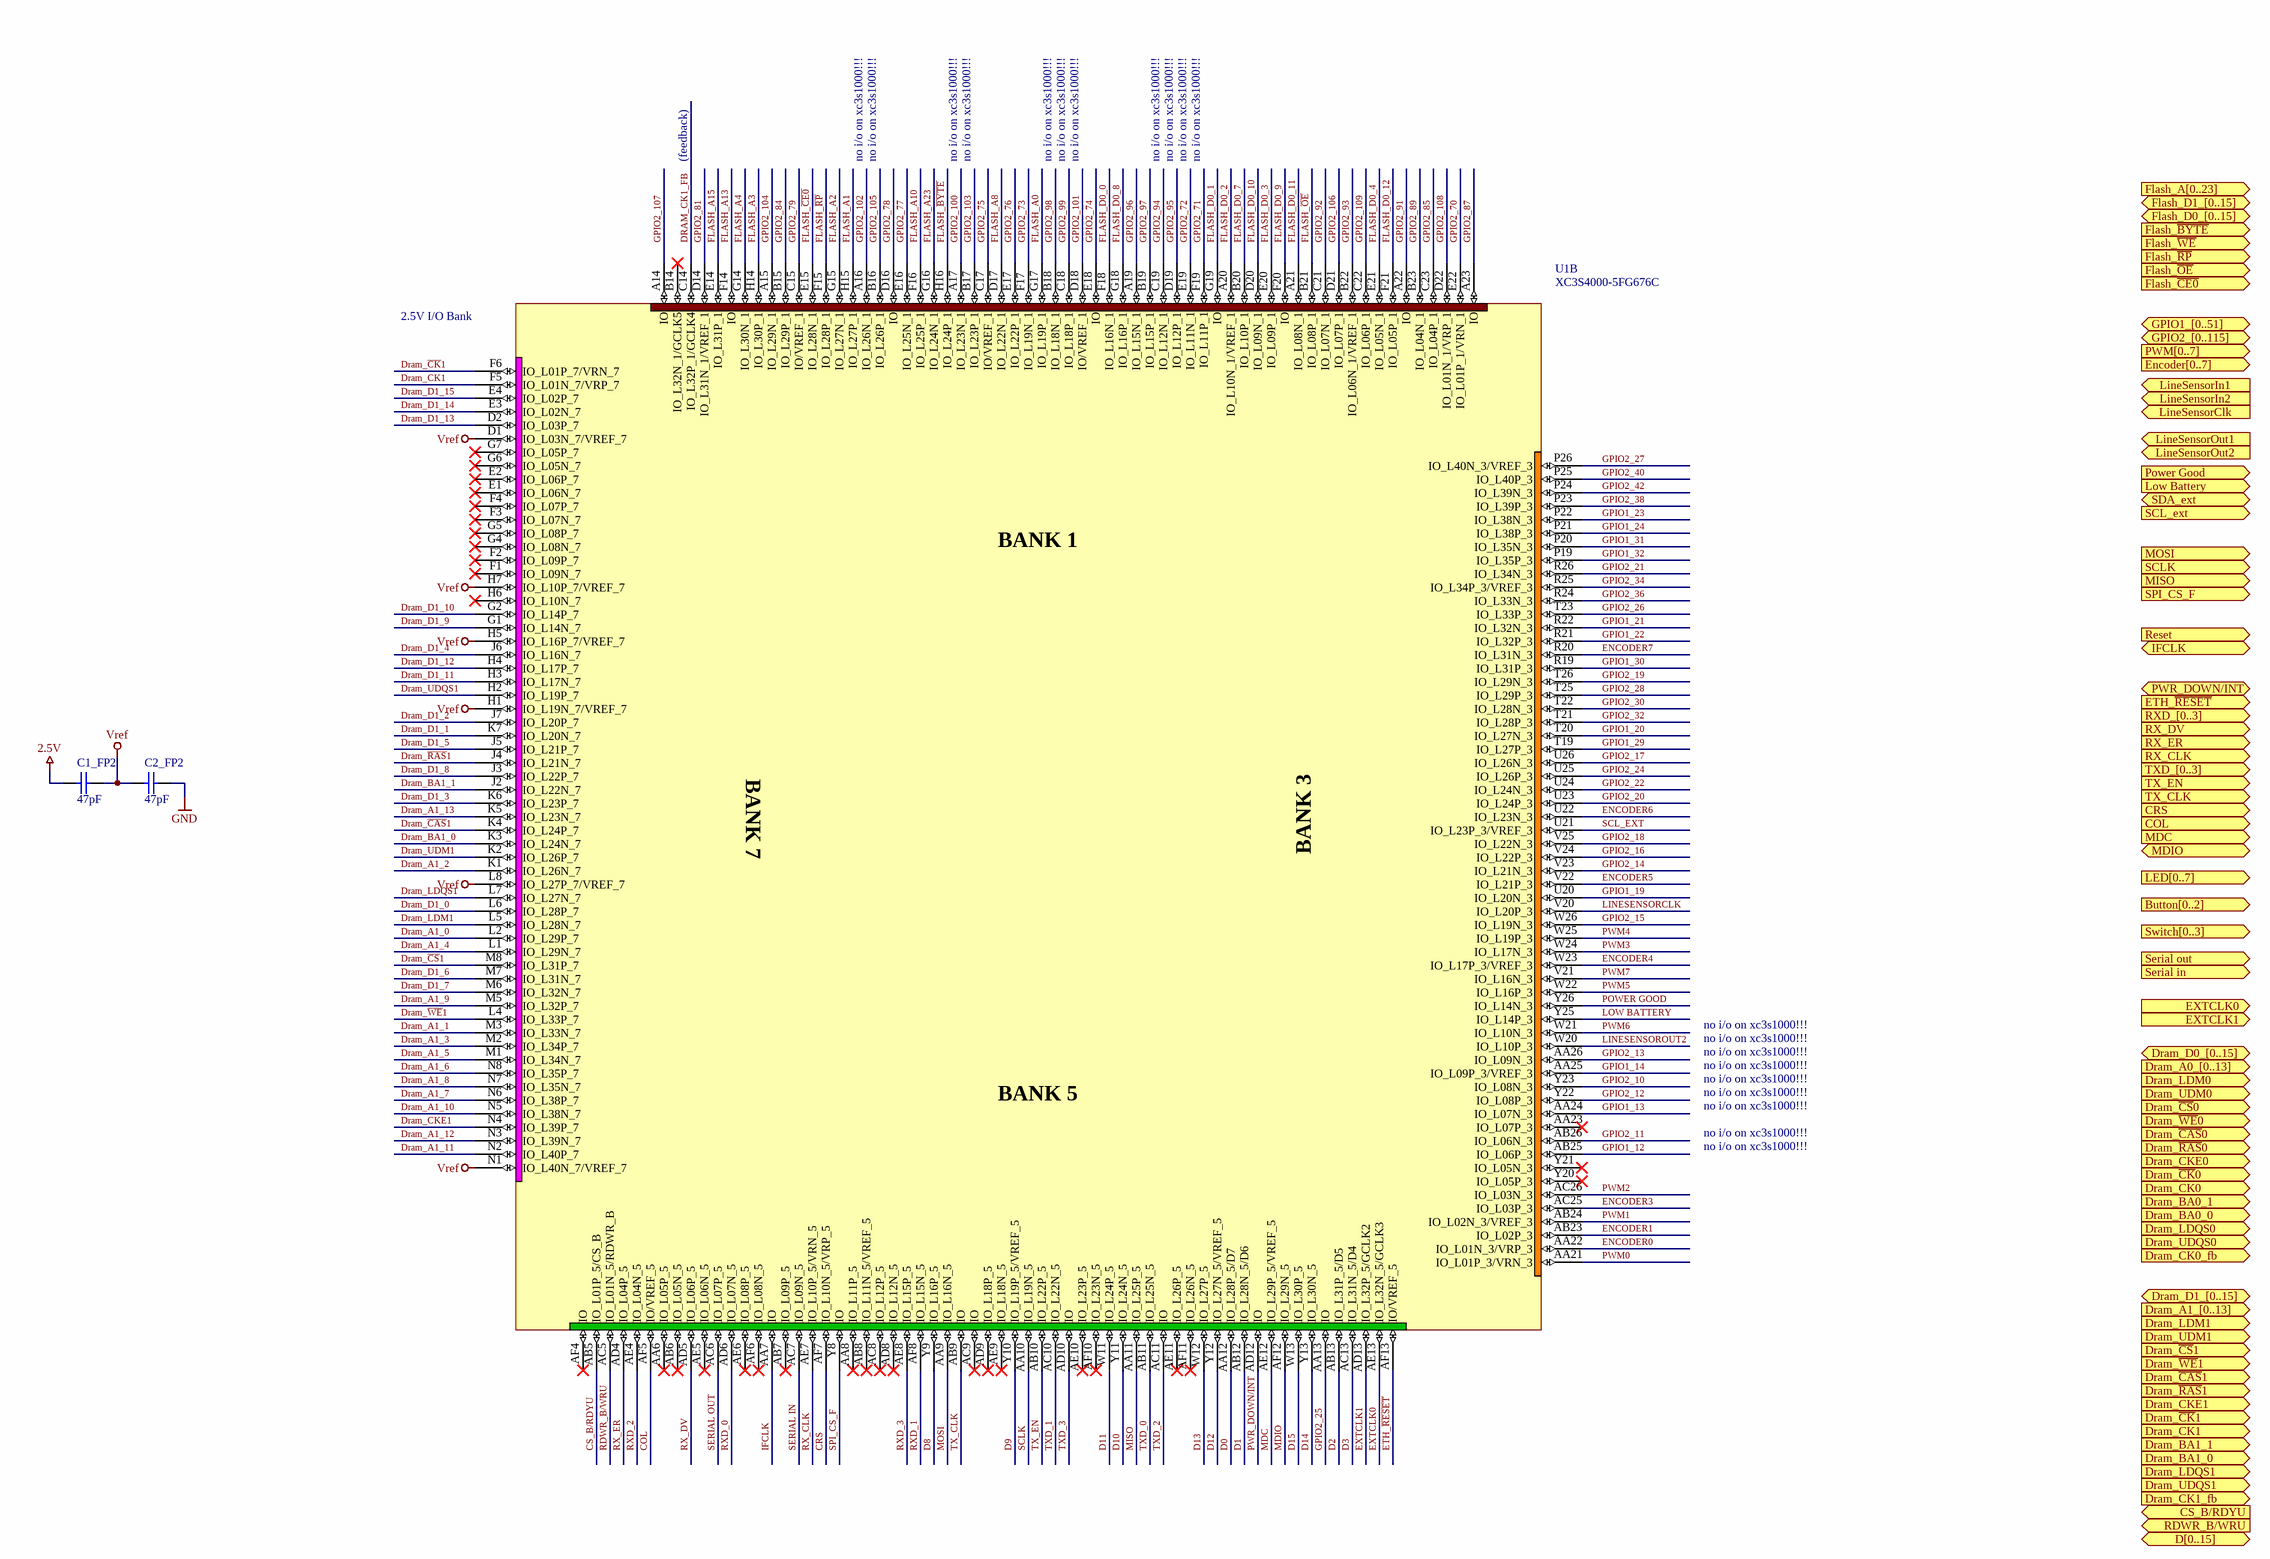
[diagram p5: fpga2.SCHDOC]

### Parts
C1_FP2  value 47pF  [0402]  (hidden comment: Cap)
C2_FP2  value 47pF  [0402]  (hidden comment: Cap)
U1  XC3S4000-5FG676C  [FG676]  (part B of 3)

### Ports
Button[0..2] (in), COL (in), CRS (in), CS_B/RDYU (in), D[0..15] (bidir), Dram_A0_[0..13] (out), Dram_A1_[0..13] (out), Dram_BA0_0 (out), Dram_BA0_1 (out), Dram_BA1_0 (out), Dram_BA1_1 (out), Dram_CK0 (out), Dram_CK0_fb (in), Dram_CK1 (out), Dram_CK1_fb (in), Dram_CKE0 (out), Dram_CKE1 (out), Dram_D0_[0..15] (bidir), Dram_D1_[0..15] (bidir), Dram_LDM0 (out), Dram_LDM1 (out), Dram_LDQS0 (out), Dram_LDQS1 (out), Dram_UDM0 (out), Dram_UDM1 (out), Dram_UDQS0 (out), Dram_UDQS1 (out), Dram_~{CAS}0 (out), Dram_~{CAS}1 (out), Dram_~{CK}0 (out), Dram_~{CK}1 (out), Dram_~{CS}0 (out), Dram_~{CS}1 (out), Dram_~{RAS}0 (out), Dram_~{RAS}1 (out), Dram_~{WE}0 (out), Dram_~{WE}1 (out), Encoder[0..7] (in), ETH_~{RESET} (out), EXTCLK0 (in), EXTCLK1 (in), Flash_A[0..23] (out), Flash_D0_[0..15] (bidir), Flash_D1_[0..15] (bidir), Flash_~{BYTE} (out), Flash_~{CE0} (out), Flash_~{OE} (out), Flash_~{RP} (out), Flash_~{WE} (out), GPIO1_[0..51] (bidir), GPIO2_[0..115] (bidir), IFCLK (bidir), LED[0..7] (out), LineSensorClk (out), LineSensorIn1 (out), LineSensorIn2 (out), LineSensorOut1 (in), LineSensorOut2 (in), Low Battery (in), MDC (out), MDIO (bidir), MISO (in), MOSI (in), Power Good (in), PWM[0..7] (out), PWR_DOWN/INT (bidir), RDWR_B/WRU (in), Reset (in), RX_CLK (in), RX_DV (in), RX_ER (in), RXD_[0..3] (in), SCL_ext (out), SCLK (in), SDA_ext (bidir), Serial in (in), Serial out (out), SPI_CS_F (in), Switch[0..3] (in), TX_CLK (in), TX_EN (out), TXD_[0..3] (out)

### Nets
2.5V: C1_FP2.2
GND: C2_FP2.1
Vref: C1_FP2.1 C2_FP2.2 U1.D1(IO_L03N_7/VREF_7) U1.H1(IO_L19N_7/VREF_7) U1.H5(IO_L16P_7/VREF_7) U1.H7(IO_L10P_7/VREF_7) U1.L8(IO_L27P_7/VREF_7) U1.N1(IO_L40N_7/VREF_7)
COL: U1.AF5(IO/VREF_5) ; port COL
CRS: U1.AF7(IO_L10N_5/VRP_5) ; port CRS
CS_B/RDYU: U1.AB5(IO_L01P_5/CS_B) ; port CS_B/RDYU
D0: U1.AA12(IO_L28P_5/D7)
D1: U1.AB12(IO_L28N_5/D6)
D2: U1.AB13(IO_L31P_5/D5)
D3: U1.AC13(IO_L31N_5/D4)
D8: U1.Y9(IO_L16P_5)
D9: U1.Y10(IO_L19P_5/VREF_5)
D10: U1.Y11(IO_L24N_5)
D11: U1.W11(IO_L24P_5)
D12: U1.Y12(IO_L27N_5/VREF_5)
D13: U1.W12(IO_L27P_5)
D14: U1.Y13(IO_L30N_5)
D15: U1.W13(IO_L30P_5)
Dram_A1_0: U1.L2(IO_L29P_7)
Dram_A1_1: U1.M3(IO_L33N_7)
Dram_A1_2: U1.K1(IO_L26N_7)
Dram_A1_3: U1.M2(IO_L34P_7)
Dram_A1_4: U1.L1(IO_L29N_7)
Dram_A1_5: U1.M1(IO_L34N_7)
Dram_A1_6: U1.N8(IO_L35P_7)
Dram_A1_7: U1.N6(IO_L38P_7)
Dram_A1_8: U1.N7(IO_L35N_7)
Dram_A1_9: U1.M5(IO_L32P_7)
Dram_A1_10: U1.N5(IO_L38N_7)
Dram_A1_11: U1.N2(IO_L40P_7)
Dram_A1_12: U1.N3(IO_L39N_7)
Dram_A1_13: U1.K5(IO_L23N_7)
Dram_BA1_0: U1.K3(IO_L24N_7) ; port Dram_BA1_0
Dram_BA1_1: U1.J2(IO_L22N_7) ; port Dram_BA1_1
Dram_~{CAS}1: U1.K4(IO_L24P_7) ; port Dram_~{CAS}1
Dram_~{CK}1: U1.F6(IO_L01P_7/VRN_7) ; port Dram_~{CK}1
Dram_~{CS}1: U1.M8(IO_L31P_7) ; port Dram_~{CS}1
Dram_CK1: U1.F5(IO_L01N_7/VRP_7) ; port Dram_CK1
DRAM_CK1_FB: U1.C14(IO_L32P_1/GCLK4) ; port Dram_CK1_fb
Dram_CKE1: U1.N4(IO_L39P_7) ; port Dram_CKE1
Dram_D1_0: U1.L6(IO_L28P_7)
Dram_D1_1: U1.K7(IO_L20N_7)
Dram_D1_2: U1.J7(IO_L20P_7)
Dram_D1_3: U1.K6(IO_L23P_7)
Dram_D1_4: U1.J6(IO_L16N_7)
Dram_D1_5: U1.J5(IO_L21P_7)
Dram_D1_6: U1.M7(IO_L31N_7)
Dram_D1_7: U1.M6(IO_L32N_7)
Dram_D1_8: U1.J3(IO_L22P_7)
Dram_D1_9: U1.G1(IO_L14N_7)
Dram_D1_10: U1.G2(IO_L14P_7)
Dram_D1_11: U1.H3(IO_L17N_7)
Dram_D1_12: U1.H4(IO_L17P_7)
Dram_D1_13: U1.D2(IO_L03P_7)
Dram_D1_14: U1.E3(IO_L02N_7)
Dram_D1_15: U1.E4(IO_L02P_7)
Dram_LDM1: U1.L5(IO_L28N_7) ; port Dram_LDM1
Dram_LDQS1: U1.L7(IO_L27N_7) ; port Dram_LDQS1
Dram_~{RAS}1: U1.J4(IO_L21N_7) ; port Dram_~{RAS}1
Dram_UDM1: U1.K2(IO_L26P_7) ; port Dram_UDM1
Dram_UDQS1: U1.H2(IO_L19P_7) ; port Dram_UDQS1
Dram_~{WE}1: U1.L4(IO_L33P_7) ; port Dram_~{WE}1
ENCODER0: U1.AA22(IO_L01N_3/VRP_3)
ENCODER1: U1.AB23(IO_L02P_3)
ENCODER3: U1.AC25(IO_L03P_3)
ENCODER4: U1.W23(IO_L17P_3/VREF_3)
ENCODER5: U1.V22(IO_L21P_3)
ENCODER6: U1.U22(IO_L23N_3)
ENCODER7: U1.R20(IO_L31N_3)
ETH_~{RESET}: U1.AF13(IO/VREF_5) ; port ETH_~{RESET}
EXTCLK0: U1.AE13(IO_L32N_5/GCLK3) ; port EXTCLK0
EXTCLK1: U1.AD13(IO_L32P_5/GCLK2) ; port EXTCLK1
FLASH_A0: U1.G17(IO_L19P_1)
FLASH_A1: U1.H15(IO_L27P_1)
FLASH_A2: U1.G15(IO_L27N_1)
FLASH_A3: U1.H14(IO_L30P_1)
FLASH_A4: U1.G14(IO_L30N_1)
FLASH_A8: U1.D17(IO_L22N_1)
FLASH_A10: U1.F16(IO_L25P_1)
FLASH_A13: U1.F14(IO)
FLASH_A15: U1.E14(IO_L31P_1)
FLASH_A23: U1.G16(IO_L24N_1)
FLASH_~{BYTE}: U1.H16(IO_L24P_1) ; port Flash_~{BYTE}
FLASH_~{CE0}: U1.E15(IO_L28N_1) ; port Flash_~{CE0}
FLASH_D0_0: U1.F18(IO_L16N_1)
FLASH_D0_1: U1.G19(IO)
FLASH_D0_2: U1.A20(IO_L10N_1/VREF_1)
FLASH_D0_3: U1.E20(IO_L09P_1)
FLASH_D0_4: U1.E21(IO_L05N_1)
FLASH_D0_7: U1.B20(IO_L10P_1)
FLASH_D0_8: U1.G18(IO_L16P_1)
FLASH_D0_9: U1.F20(IO)
FLASH_D0_10: U1.D20(IO_L09N_1)
FLASH_D0_11: U1.A21(IO_L08N_1)
FLASH_D0_12: U1.F21(IO_L05P_1)
FLASH_~{OE}: U1.B21(IO_L08P_1) ; port Flash_~{OE}
FLASH_~{RP}: U1.F15(IO_L28P_1) ; port Flash_~{RP}
GPIO1_12: U1.AB25(IO_L06P_3)
GPIO1_13: U1.AA24(IO_L07N_3)
GPIO1_14: U1.AA25(IO_L09P_3/VREF_3)
GPIO1_19: U1.U20(IO_L20N_3)
GPIO1_20: U1.T20(IO_L27N_3)
GPIO1_21: U1.R22(IO_L32N_3)
GPIO1_22: U1.R21(IO_L32P_3)
GPIO1_23: U1.P22(IO_L38N_3)
GPIO1_24: U1.P21(IO_L38P_3)
GPIO1_29: U1.T19(IO_L27P_3)
GPIO1_30: U1.R19(IO_L31P_3)
GPIO1_31: U1.P20(IO_L35N_3)
GPIO1_32: U1.P19(IO_L35P_3)
GPIO2_10: U1.Y23(IO_L08N_3)
GPIO2_11: U1.AB26(IO_L06N_3)
GPIO2_12: U1.Y22(IO_L08P_3)
GPIO2_13: U1.AA26(IO_L09N_3)
GPIO2_14: U1.V23(IO_L21N_3)
GPIO2_15: U1.W26(IO_L19N_3)
GPIO2_16: U1.V24(IO_L22P_3)
GPIO2_17: U1.U26(IO_L26N_3)
GPIO2_18: U1.V25(IO_L22N_3)
GPIO2_19: U1.T26(IO_L29N_3)
GPIO2_20: U1.U23(IO_L24P_3)
GPIO2_21: U1.R26(IO_L34N_3)
GPIO2_22: U1.U24(IO_L24N_3)
GPIO2_24: U1.U25(IO_L26P_3)
GPIO2_25: U1.AA13(IO)
GPIO2_26: U1.T23(IO_L33P_3)
GPIO2_27: U1.P26(IO_L40N_3/VREF_3)
GPIO2_28: U1.T25(IO_L29P_3)
GPIO2_30: U1.T22(IO_L28N_3)
GPIO2_32: U1.T21(IO_L28P_3)
GPIO2_34: U1.R25(IO_L34P_3/VREF_3)
GPIO2_36: U1.R24(IO_L33N_3)
GPIO2_38: U1.P23(IO_L39P_3)
GPIO2_40: U1.P25(IO_L40P_3)
GPIO2_42: U1.P24(IO_L39N_3)
GPIO2_70: U1.E22(IO_L01P_1/VRN_1)
GPIO2_71: U1.F19(IO_L11P_1)
GPIO2_72: U1.E19(IO_L11N_1)
GPIO2_73: U1.F17(IO_L19N_1)
GPIO2_74: U1.E18(IO)
GPIO2_75: U1.C17(IO/VREF_1)
GPIO2_76: U1.E17(IO_L22P_1)
GPIO2_77: U1.E16(IO_L25N_1)
GPIO2_78: U1.D16(IO)
GPIO2_79: U1.C15(IO/VREF_1)
GPIO2_81: U1.D14(IO_L31N_1/VREF_1)
GPIO2_84: U1.B15(IO_L29P_1)
GPIO2_85: U1.C23(IO_L04P_1)
GPIO2_87: U1.A23(IO)
GPIO2_89: U1.B23(IO_L04N_1)
GPIO2_91: U1.A22(IO)
GPIO2_92: U1.C21(IO_L07N_1)
GPIO2_93: U1.B22(IO_L06N_1/VREF_1)
GPIO2_94: U1.C19(IO_L12N_1)
GPIO2_95: U1.D19(IO_L12P_1)
GPIO2_96: U1.A19(IO_L15N_1)
GPIO2_97: U1.B19(IO_L15P_1)
GPIO2_98: U1.B18(IO_L18N_1)
GPIO2_99: U1.C18(IO_L18P_1)
GPIO2_100: U1.A17(IO_L23N_1)
GPIO2_101: U1.D18(IO/VREF_1)
GPIO2_102: U1.A16(IO_L26N_1)
GPIO2_103: U1.B17(IO_L23P_1)
GPIO2_104: U1.A15(IO_L29N_1)
GPIO2_105: U1.B16(IO_L26P_1)
GPIO2_106: U1.D21(IO_L07P_1)
GPIO2_107: U1.A14(IO)
GPIO2_108: U1.D22(IO_L01N_1/VRP_1)
GPIO2_109: U1.C22(IO_L06P_1)
IFCLK: U1.AA7(IO) ; port IFCLK
LINESENSORCLK: U1.V20(IO_L20P_3) ; port LineSensorClk
LINESENSOROUT2: U1.W20(IO_L10P_3) ; port LineSensorOut2
LOW BATTERY: U1.Y25(IO_L14P_3) ; port Low Battery
MDC: U1.AE12(IO_L29P_5/VREF_5) ; port MDC
MDIO: U1.AF12(IO_L29N_5) ; port MDIO
MISO: U1.AA11(IO_L25P_5) ; port MISO
MOSI: U1.AA9(IO_L16N_5) ; port MOSI
POWER GOOD: U1.Y26(IO_L14N_3) ; port Power Good
PWM0: U1.AA21(IO_L01P_3/VRN_3)
PWM1: U1.AB24(IO_L02N_3/VREF_3)
PWM2: U1.AC26(IO_L03N_3)
PWM3: U1.W24(IO_L17N_3)
PWM4: U1.W25(IO_L19P_3)
PWM5: U1.W22(IO_L16P_3)
PWM6: U1.W21(IO_L10N_3)
PWM7: U1.V21(IO_L16N_3)
PWR_DOWN/INT: U1.AD12(IO) ; port PWR_DOWN/INT
RDWR_B/WRU: U1.AC5(IO_L01N_5/RDWR_B) ; port RDWR_B/WRU
RX_CLK: U1.AE7(IO_L10P_5/VRN_5) ; port RX_CLK
RX_DV: U1.AD5(IO_L06P_5) ; port RX_DV
RX_ER: U1.AD4(IO_L04P_5) ; port RX_ER
RXD_0: U1.AD6(IO_L07N_5)
RXD_1: U1.AF8(IO_L15N_5)
RXD_2: U1.AE4(IO_L04N_5)
RXD_3: U1.AE8(IO_L15P_5)
SCL_EXT: U1.U21(IO_L23P_3/VREF_3) ; port SCL_ext
SCLK: U1.AA10(IO_L19N_5) ; port SCLK
SERIAL IN: U1.AC7(IO_L09N_5) ; port Serial in
SERIAL OUT: U1.AC6(IO_L07P_5) ; port Serial out
SPI_CS_F: U1.Y8(IO) ; port SPI_CS_F
TX_CLK: U1.AB9(IO) ; port TX_CLK
TX_EN: U1.AB10(IO_L22P_5) ; port TX_EN
TXD_0: U1.AB11(IO_L25N_5)
TXD_1: U1.AC10(IO_L22N_5)
TXD_2: U1.AC11(IO)
TXD_3: U1.AD10(IO)

Not connected (* = marked no-connect by the designer): U1 AA6(IO_L05P_5)* AA8(IO_L11P_5)* AA23(IO_L07P_3)* AB6(IO_L05N_5)* AB7(IO_L09P_5)* AB8(IO_L11N_5/VREF_5)* AC8(IO_L12P_5)* AC9(IO)* AD8(IO_L12N_5)* AD9(IO_L18P_5)* AE5(IO_L06N_5)* AE6(IO_L08P_5)* AE9(IO_L18N_5)* AE10(IO_L23P_5)* AE11(IO_L26P_5)* AF4(IO)* AF6(IO_L08N_5)* AF10(IO_L23N_5)* AF11(IO_L26N_5)* B14(IO_L32N_1/GCLK5)* E1(IO_L06N_7)* E2(IO_L06P_7)* F1(IO_L09N_7)* F2(IO_L09P_7)* F3(IO_L07N_7)* F4(IO_L07P_7)* G4(IO_L08N_7)* G5(IO_L08P_7)* G6(IO_L05N_7)* G7(IO_L05P_7)* H6(IO_L10N_7)* Y20(IO_L05P_3)* Y21(IO_L05N_3)*

### Notes on the sheet
- (feedback)
- no i/o on xc3s1000!!!
- (near U1) 2.5V I/O Bank
- Title:
- Size:
- Date:
- File:
- A2_L
- Author:
- Time:
- Revision:
- Sheet
- of
- (in symbol XC3S1500-5FG676C, part B) BANK 1; BANK 7; BANK 3; BANK 5

### Library data of the parts
C1_FP2 C2_FP2 = Cap: as C1_FP1 on sheet fpga1; Published: 8-Jun-2000; Revision: July-2002: Re-released for DXP Platform.; Publisher: Altium Limited; Class II: Capacitor; Distributor Number: 8819 670; RoHS: yes; Distributor: Farnell
U1 = XC3S1500-5FG676C: as U1 on sheet fpga1; Published: 17-Sep-2003; LatestRevisionDate: 6-Jun-2005; LatestRevisionNote: Bubble removed from PROG_B pin.; DatasheetDocument: 04-Mar-2004; PackageReference: FG676; Publisher: Altium Limited; Code_JEDEC: MS-034-AAL-1; Code_IPC: PBGA 27X27 FE676; ComponentLink1Description: Manufacturer Link; ComponentLink1URL: http://www.xilinx.com/xlnx/xil_prodcat_landingpage.jsp?title=Spartan-3; ComponentLink2Description: Datasheet; ComponentLink2URL: http://direct.xilinx.com/bvdocs/publications/ds099.pdf; Value: XC3S4000-5FG676C; Distributor Number: XC3S40005FGG676C; Part Number: XC3S4000-5FG676C; RoHS: yes; Distributor: Silica

## Sheet spi-flash.SchDoc: SPI Serial Flash
size A4; Organization: Berne University of Applied Science; Address1: School of Engineering and; Address2: Information Technology; Address3: Quellgasse 21; Address4: CH-2501 Biel; Revision: 1.0; SheetNumber: 16; SheetTotal: 19; ApprovedBy: zem1; Author: zac1
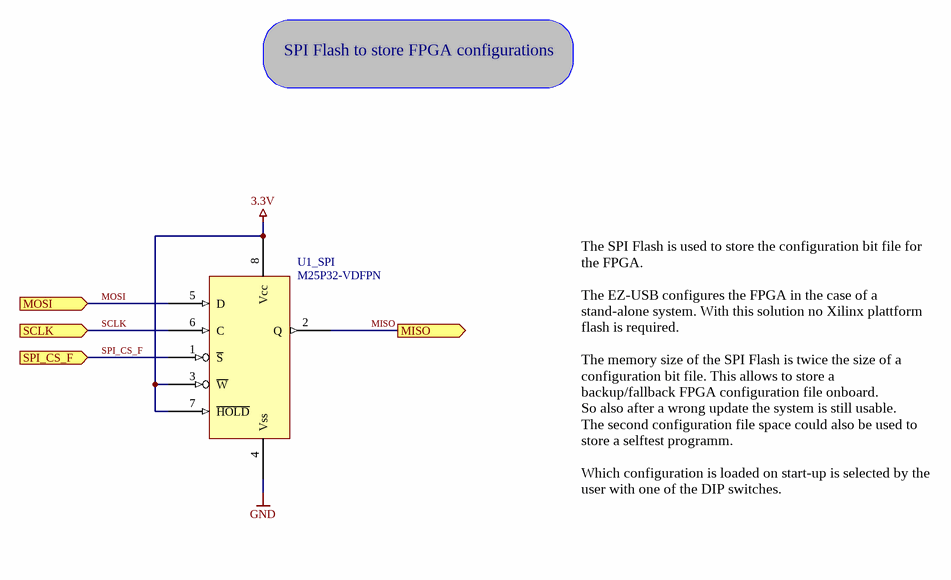
[diagram p6: spi-flash.SchDoc]

### Parts
U1_SPI  value M25P32-VDFPN  [VDFPN8]  (hidden comment: M25P32)

### Ports
MISO (out), MOSI (in), SCLK (in), SPI_CS_F (in)

### Nets
3.3V: U1_SPI.3(~{W}) U1_SPI.7(~{HOLD}) U1_SPI.8(Vcc)
GND: U1_SPI.4(Vss)
MISO: U1_SPI.2(Q) ; port MISO
MOSI: U1_SPI.5(D) ; port MOSI
SCLK: U1_SPI.6(C) ; port SCLK
SPI_CS_F: U1_SPI.1(~{S}) ; port SPI_CS_F

### Notes on the sheet
- SPI Flash to store FPGA configurations
- The SPI Flash is used to store the configuration bit file for the FPGA.
  The EZ-USB configures the FPGA in the case of a stand-alone system. With this solution no Xilinx plattform flash is required.
  The memory size of the SPI Flash is twice the size of a configuration bit file. This allows to store a backup/fallback FPGA configuration file onboard.
  So also after a wrong update the system is still usable.
  The second configuration file space could also be used to store a selftest programm.
  Which configuration is loaded on start-up is selected by the user with one of the DIP switches.
- Title:
- Size:
- Date:
- A4_L
- Author:
- Time:
- Revision:
- Sheet
- of
- File:

### Library data of the parts
U1_SPI = M25P32: Serial Flash Memory, Low Voltage, 50 MHz SPI Bus; Manufacturer: ST; Part Number: M25P32-VME6G; Currency: CHF; lead time: 12 Weeks; Packaging unit: 320; Prize: 6.92; Distributor: Silica; Distributor Number: M25P32VME6G; RoHS: yes

## Sheet ethernet.SCHDOC: Ethernet PHY
size A4; Organization: Berne University of Applied Science; Address1: School of Engineering and; Address2: Information Technology; Address3: Quellgasse 21; Address4: CH-2501 Biel; Revision: 1.0; SheetNumber: 13; SheetTotal: 19; ApprovedBy: zem1; Author: zac1
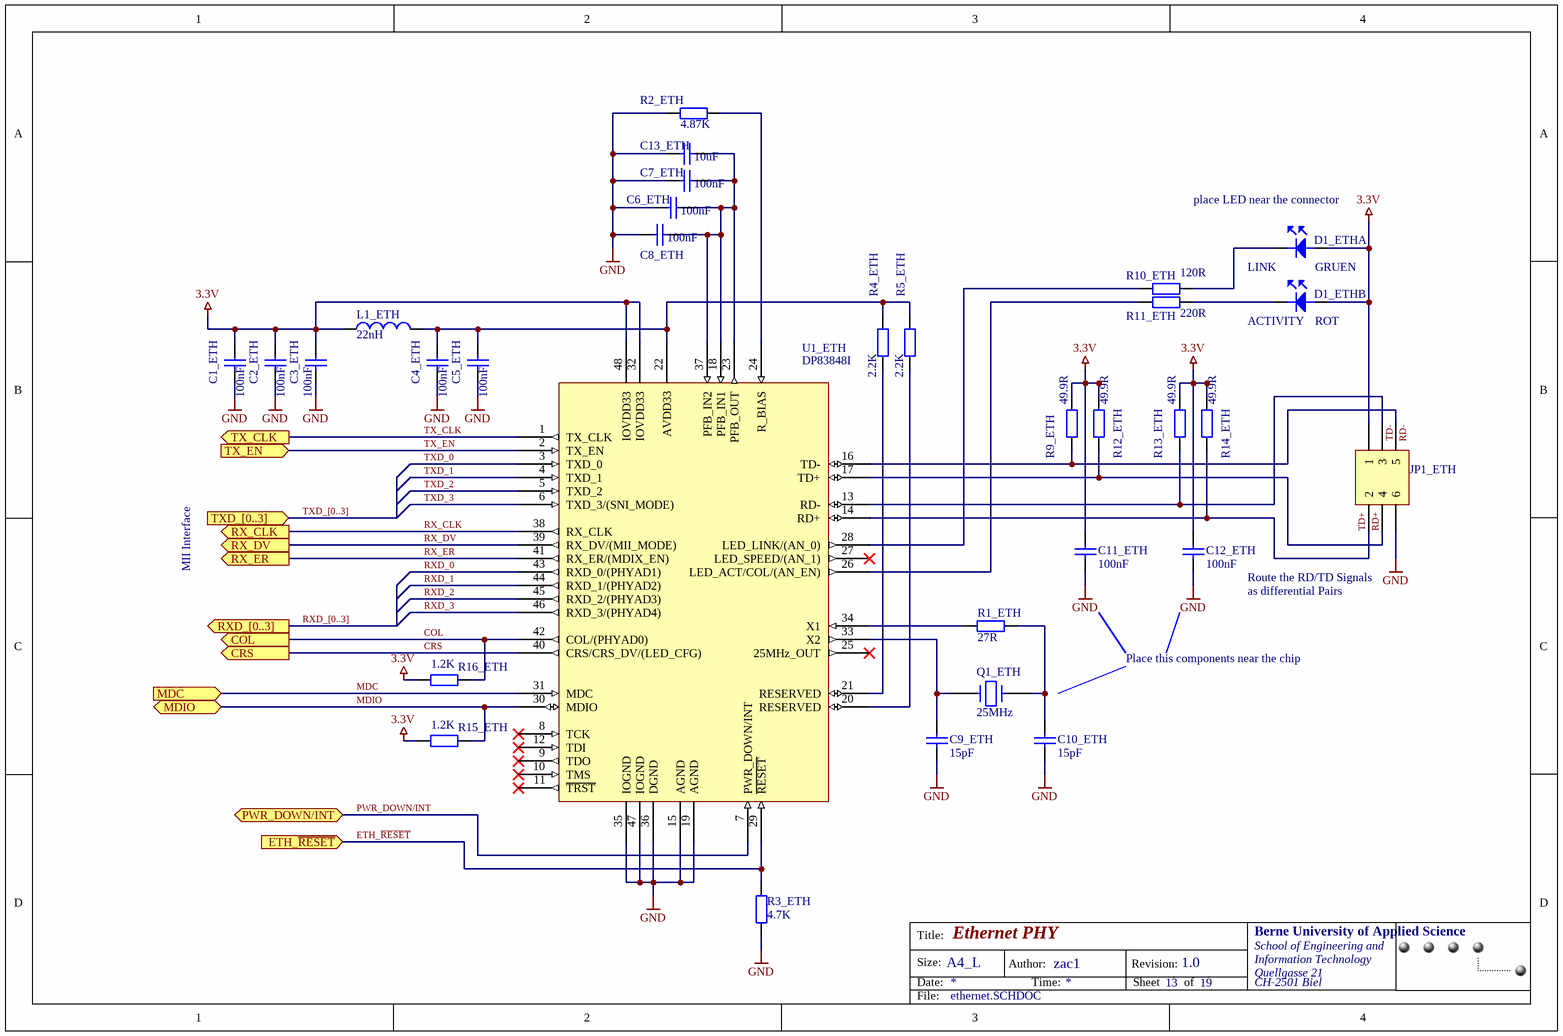
[diagram p7: ethernet.SCHDOC]

### Parts
C1_ETH  value 100nF  [0402]  (hidden comment: Cap)
C2_ETH  value 100nF  [0402]  (hidden comment: Cap)
C3_ETH  value 100nF  [0402]  (hidden comment: Cap)
C4_ETH  value 100nF  [0402]  (hidden comment: Cap)
C5_ETH  value 100nF  [0402]  (hidden comment: Cap)
C6_ETH  value 100nF  [0402]  (hidden comment: Cap)
C7_ETH  value 100nF  [0402]  (hidden comment: Cap)
C8_ETH  value 100nF  [0402]  (hidden comment: Cap)
C9_ETH  value 15pF  [0402]  (hidden comment: Cap)
C10_ETH  value 15pF  [0402]  (hidden comment: Cap)
C11_ETH  value 100nF  [0402]  (hidden comment: Cap)
C12_ETH  value 100nF  [0402]  (hidden comment: Cap)
C13_ETH  value 10uF  [1206]  (hidden comment: Cap)
D1_ETH  1211C-LED  [stan-led4]  (value not drawn)  (parts A,B of 2)
JP1_ETH  M22-2540305  [M22-2540305]  (value not drawn)
L1_ETH  value 22nH  [0603]  (hidden comment: Inductor)
Q1_ETH  value 25MHz  [AT49]  (hidden comment: QUARZ-SMD)
R1_ETH  value 27R  [0402]  (hidden comment: Res2)
R2_ETH  value 4.87K  [0603]  (hidden comment: Res2)
R3_ETH  value 4.7K  [0402]  (hidden comment: Res2)
R4_ETH  value 2.2K  [0402]  (hidden comment: Res2)
R5_ETH  value 2.2K  [0402]  (hidden comment: Res2)
R9_ETH  value 49.9R  [0603]  (hidden comment: Res2)
R10_ETH  value 120R  [0402]  (hidden comment: Res2)
R11_ETH  value 220R  [0402]  (hidden comment: Res2)
R12_ETH  value 49.9R  [0603]  (hidden comment: Res2)
R13_ETH  value 49.9R  [0603]  (hidden comment: Res2)
R14_ETH  value 49.9R  [0603]  (hidden comment: Res2)
R15_ETH  value 1.2K  [0402]  (hidden comment: Res2)
R16_ETH  value 1.2K  [0402]  (hidden comment: Res2)
U1_ETH  DP83848I  [F-QFP7X7-G48/N]

### Ports
COL (out), CRS (out), ETH_~{RESET} (in), MDC (in), MDIO (bidir), PWR_DOWN/INT (bidir), RX_CLK (out), RX_DV (out), RX_ER (out), RXD_[0..3] (out), TX_CLK (out), TX_EN (in), TXD_[0..3] (in)

### Nets
3.3V: C1_ETH.2 C2_ETH.2 C3_ETH.2 C11_ETH.2 C12_ETH.2 D1_ETH.1(A) D1_ETH.3(A) JP1_ETH.1 L1_ETH.1 R9_ETH.2 R12_ETH.2 R13_ETH.2 R14_ETH.2 R15_ETH.1 R16_ETH.1 U1_ETH.32(IOVDD33) U1_ETH.48(IOVDD33)
GND: C1_ETH.1 C2_ETH.1 C3_ETH.1 C4_ETH.1 C5_ETH.1 C6_ETH.1 C7_ETH.1 C8_ETH.1 C9_ETH.1 C10_ETH.1 C11_ETH.1 C12_ETH.1 C13_ETH.1 JP1_ETH.6 R2_ETH.1 R3_ETH.1 U1_ETH.15(AGND) U1_ETH.19(AGND) U1_ETH.35(IOGND) U1_ETH.36(DGND) U1_ETH.47(IOGND)
COL: R16_ETH.2 U1_ETH.42(COL/(PHYAD0)) ; port COL
CRS: U1_ETH.40(CRS/CRS_DV/(LED_CFG)) ; port CRS
ETH_~{RESET}: R3_ETH.2 U1_ETH.29(~{RESET}) ; port ETH_~{RESET}
MDC: U1_ETH.31(MDC) ; port MDC
MDIO: R15_ETH.2 U1_ETH.30(MDIO) ; port MDIO
PWR_DOWN/INT: U1_ETH.7(PWR_DOWN/INT) ; port PWR_DOWN/INT
RD+: JP1_ETH.4 R12_ETH.1 U1_ETH.17(TD+)
RD-: JP1_ETH.5 R9_ETH.1 U1_ETH.16(TD-)
RX_CLK: U1_ETH.38(RX_CLK) ; port RX_CLK
RX_DV: U1_ETH.39(RX_DV/(MII_MODE)) ; port RX_DV
RX_ER: U1_ETH.41(RX_ER/(MDIX_EN)) ; port RX_ER
RXD_0: U1_ETH.43(RXD_0/(PHYAD1))
RXD_1: U1_ETH.44(RXD_1/(PHYAD2))
RXD_2: U1_ETH.45(RXD_2/(PHYAD3))
RXD_3: U1_ETH.46(RXD_3/(PHYAD4))
TD+: JP1_ETH.2 R14_ETH.1 U1_ETH.14(RD+)
TD-: JP1_ETH.3 R13_ETH.1 U1_ETH.13(RD-)
TX_CLK: U1_ETH.1(TX_CLK) ; port TX_CLK
TX_EN: U1_ETH.2(TX_EN) ; port TX_EN
TXD_0: U1_ETH.3(TXD_0)
TXD_1: U1_ETH.4(TXD_1)
TXD_2: U1_ETH.5(TXD_2)
TXD_3: U1_ETH.6(TXD_3/(SNI_MODE))
NetC4_ETH_2: C4_ETH.2 C5_ETH.2 L1_ETH.2 R4_ETH.2 R5_ETH.2 U1_ETH.22(AVDD33)
NetC6_ETH_2: C6_ETH.2 C7_ETH.2 C8_ETH.2 C13_ETH.2 U1_ETH.18(PFB_IN1) U1_ETH.23(PFB_OUT) U1_ETH.37(PFB_IN2)
NetC9_ETH_2: C9_ETH.2 Q1_ETH.1 U1_ETH.33(X2)
NetC10_ETH_2: C10_ETH.2 Q1_ETH.2 R1_ETH.1
NetD1_ETH_2: D1_ETH.2(K) R11_ETH.1
NetD1_ETH_4: D1_ETH.4(K) R10_ETH.1
NetR1_ETH_2: R1_ETH.2 U1_ETH.34(X1)
NetR2_ETH_2: R2_ETH.2 U1_ETH.24(R_BIAS)
NetR4_ETH_1: R4_ETH.1 U1_ETH.21(RESERVED)
NetR5_ETH_1: R5_ETH.1 U1_ETH.20(RESERVED)
NetR10_ETH_2: R10_ETH.2 U1_ETH.28(LED_LINK/(AN_0))
NetR11_ETH_2: R11_ETH.2 U1_ETH.26(LED_ACT/COL/(AN_EN))

Not connected (* = marked no-connect by the designer): U1_ETH 8(TCK)* 9(TDO)* 10(TMS)* 11(~{TRST})* 12(TDI)* 25(25MHz_OUT)* 27(LED_SPEED/(AN_1))*

### Buses and harness runs
bus RXD_[0..3] = port RXD_[0..3]
bus TXD_[0..3] = port TXD_[0..3]

### Notes on the sheet
- (near D1_ETH) place LED near the connector
- (near D1_ETH) LINK
- (near D1_ETH) ACTIVITY
- MII Interface
- Route the RD/TD Signals
- as differential Pairs
- Place this components near the chip
- Title:
- Size:
- Date:
- A4_L
- Author:
- Time:
- Revision:
- Sheet
- of
- File:
- (in symbol 1211C-LED, part A) GRUEN
- (in symbol 1211C-LED, part B) ROT

### Library data of the parts
C1_ETH C2_ETH C3_ETH C4_ETH C5_ETH C6_ETH C7_ETH C8_ETH C11_ETH C12_ETH = Cap: Capacitor; Manufacturer: Murata; Part Number: GRM155R71C104KA88D; Class I: Passive; Currency: CHF; Packaging unit: 10; Prize: 0.07; Published: 8-Jun-2000; Revision: July-2002: Re-released for DXP Platform.; Publisher: Altium Limited; Class II: Capacitor; Distributor Number: 8819 742; RoHS: yes; Distributor: Farnell
C9_ETH C10_ETH = Cap: Capacitor; Manufacturer: AVX; Part Number: 04025A150JAT2A; Class I: Passive; Currency: CHF; Packaging unit: 1; Prize: 0.07; Published: 8-Jun-2000; Revision: July-2002: Re-released for DXP Platform.; Publisher: Altium Limited; Class II: Capacitor; Distributor Number: 1327 631; RoHS: yes; Distributor: Farnell
C13_ETH = Cap: Capacitor; Manufacturer: Murata; Part Number: GRM31CR70J106KA01L; Class I: Passive; Currency: CHF; Packaging unit: 1; Prize: 0.25; Published: 8-Jun-2000; Revision: July-2002: Re-released for DXP Platform.; Publisher: Altium Limited; Class II: Capacitor; Distributor Number: 9527 729; RoHS: yes; Distributor: Farnell
D1_ETH = 1211C-LED: Stanley 1211C Bi-Color Ultra Compact SMT LED; Value: BRBG1211C; Currency: CHF; Packaging unit: 1; Prize: 0.86; Distributor Number: 253183; Manufacturer: Stanley; Part Number: BRBG1211C; RoHS: yes; Distributor: Distrelec
JP1_ETH = M22-2540305: Manufacturer: HARWIN; Part Number: M22F2040305; Currency: CHF; Packaging unit: 1; Prize: 2.3; VALUE: M22-2540305; Distributor Number: 672 210; RoHS: yes; Distributor: Farnell
L1_ETH = Inductor: Manufacturer: Panasonic; Part Number: ELJRE22NJFA; Class I: Passive; Currency: CHF; Packaging unit: 5; Prize: 0.45; Published: 8-Jun-2000; Revision: July-2002: Re-released for DXP Platform.; Publisher: Altium Limited; Class II: Inductor; Distributor Number: 1198381; RoHS: yes; Distributor: Farnell
Q1_ETH = QUARZ-SMD: SMD Quarz in the AT49 Case, like the ABLS series from Abracon; Part Number: ABLS-25.000MHZ-B2F-T; Currency: CHF; Packaging unit: 1; Prize: 0.53; lead time: 2 Weeks; Distributor Number: 7940579; Manufacturer: ABRACON; RoHS: yes; Distributor: Farnell
R1_ETH = Res2: as R2_FP1 on sheet fpga1; Published: 8-Jun-2000; Revision: July-2002: Re-released for DXP Platform.; Publisher: Altium Limited; Class II: Resistor; Distributor Number: 9239049; RoHS: yes; Distributor: Farnell
R2_ETH = Res2: Resistor; Manufacturer: Multicomp; Part Number: MC 0.063W 0603 1% 4K87; Class I: Passive; Currency: CHF; Packaging unit: 50; Prize: 0.09; Published: 8-Jun-2000; Revision: July-2002: Re-released for DXP Platform.; Publisher: Altium Limited; Class II: Resistor; Distributor Number: 1170858; RoHS: X-yes; Distributor: Farnell
R3_ETH = Res2: as R1_FP1 on sheet fpga1; Published: 8-Jun-2000; Revision: July-2002: Re-released for DXP Platform.; Publisher: Altium Limited; Class II: Resistor; Distributor Number: 9239316; RoHS: yes; Distributor: Farnell
R4_ETH R5_ETH = Res2: Resistor; Manufacturer: PHYCOMP; Part Number: 232270672202; Class I: Passive; Currency: CHF; Packaging unit: 50; Prize: 0.12; Published: 8-Jun-2000; Revision: July-2002: Re-released for DXP Platform.; Publisher: Altium Limited; Class II: Resistor; Distributor Number: 9239278; RoHS: yes; Distributor: Farnell
R9_ETH R12_ETH R13_ETH R14_ETH = Res2: Resistor; Manufacturer: Multicomp; Part Number: MC 0.063W 0603 1% 49R9; Class I: Passive; Currency: CHF; Packaging unit: 50; Prize: 0.06; Published: 8-Jun-2000; Revision: July-2002: Re-released for DXP Platform.; Publisher: Altium Limited; Class II: Resistor; Distributor Number: 1170658; RoHS: X-yes; Distributor: Farnell
R10_ETH = Res2: Resistor; Manufacturer: PHYCOMP; Part Number: 232270671201; Class I: Passive; Currency: CHF; Packaging unit: 50; Prize: 0.12; Published: 8-Jun-2000; Revision: July-2002: Re-released for DXP Platform.; Publisher: Altium Limited; Class II: Resistor; Distributor Number: 9239120; RoHS: yes; Distributor: Farnell
R11_ETH = Res2: Resistor; Manufacturer: PHYCOMP; Part Number: 232270672201; Class I: Passive; Currency: CHF; Packaging unit: 50; Prize: 0.12; Published: 8-Jun-2000; Revision: July-2002: Re-released for DXP Platform.; Publisher: Altium Limited; Class II: Resistor; Distributor Number: 9239154; RoHS: yes; Distributor: Farnell
R15_ETH R16_ETH = Res2: Resistor; Manufacturer: PHYCOMP; Part Number: 232270671202; Class I: Passive; Currency: CHF; Packaging unit: 50; Prize: 0.12; Published: 8-Jun-2000; Revision: July-2002: Re-released for DXP Platform.; Publisher: Altium Limited; Class II: Resistor; Distributor Number: 9239243; RoHS: yes; Distributor: Farnell
U1_ETH = DP83848I: Single Port 10/100 Mb/s Ethernet Physical Layer Transceiver; Manufacturer: National; Part Number: DP83848IVV/NOPB; Currency: CHF; Packaging unit: 1; Prize: 5.55; Value: DP83848I; Distributor Number: DP83848IVV/NOPB; RoHS: yes; Distributor: EBV